# EAGLE board alu4 (EAGLE 7.6.0), part 1 of 2
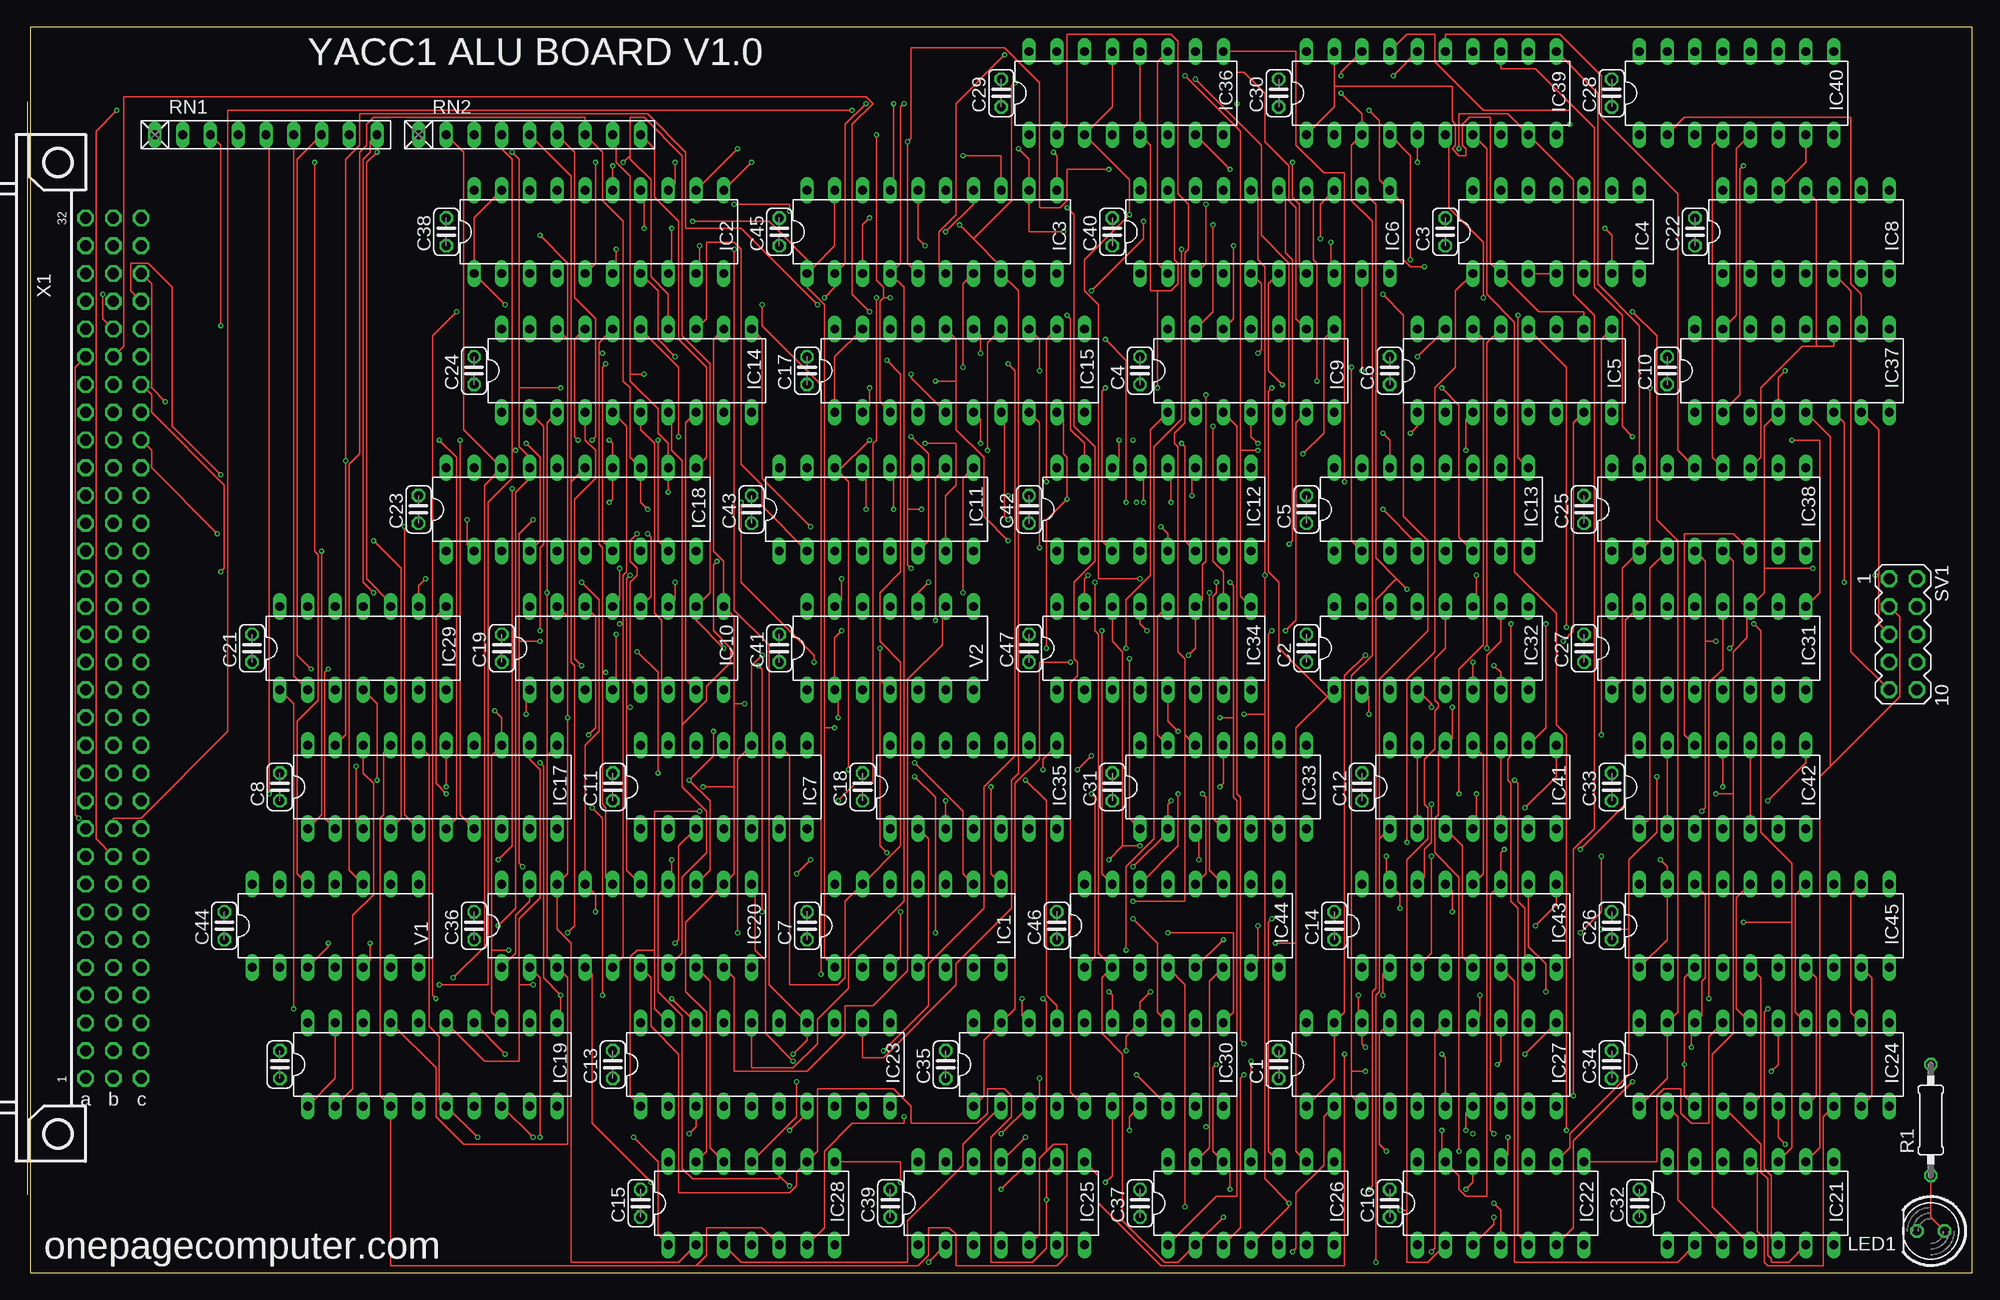
[diagram p10: board, top side]
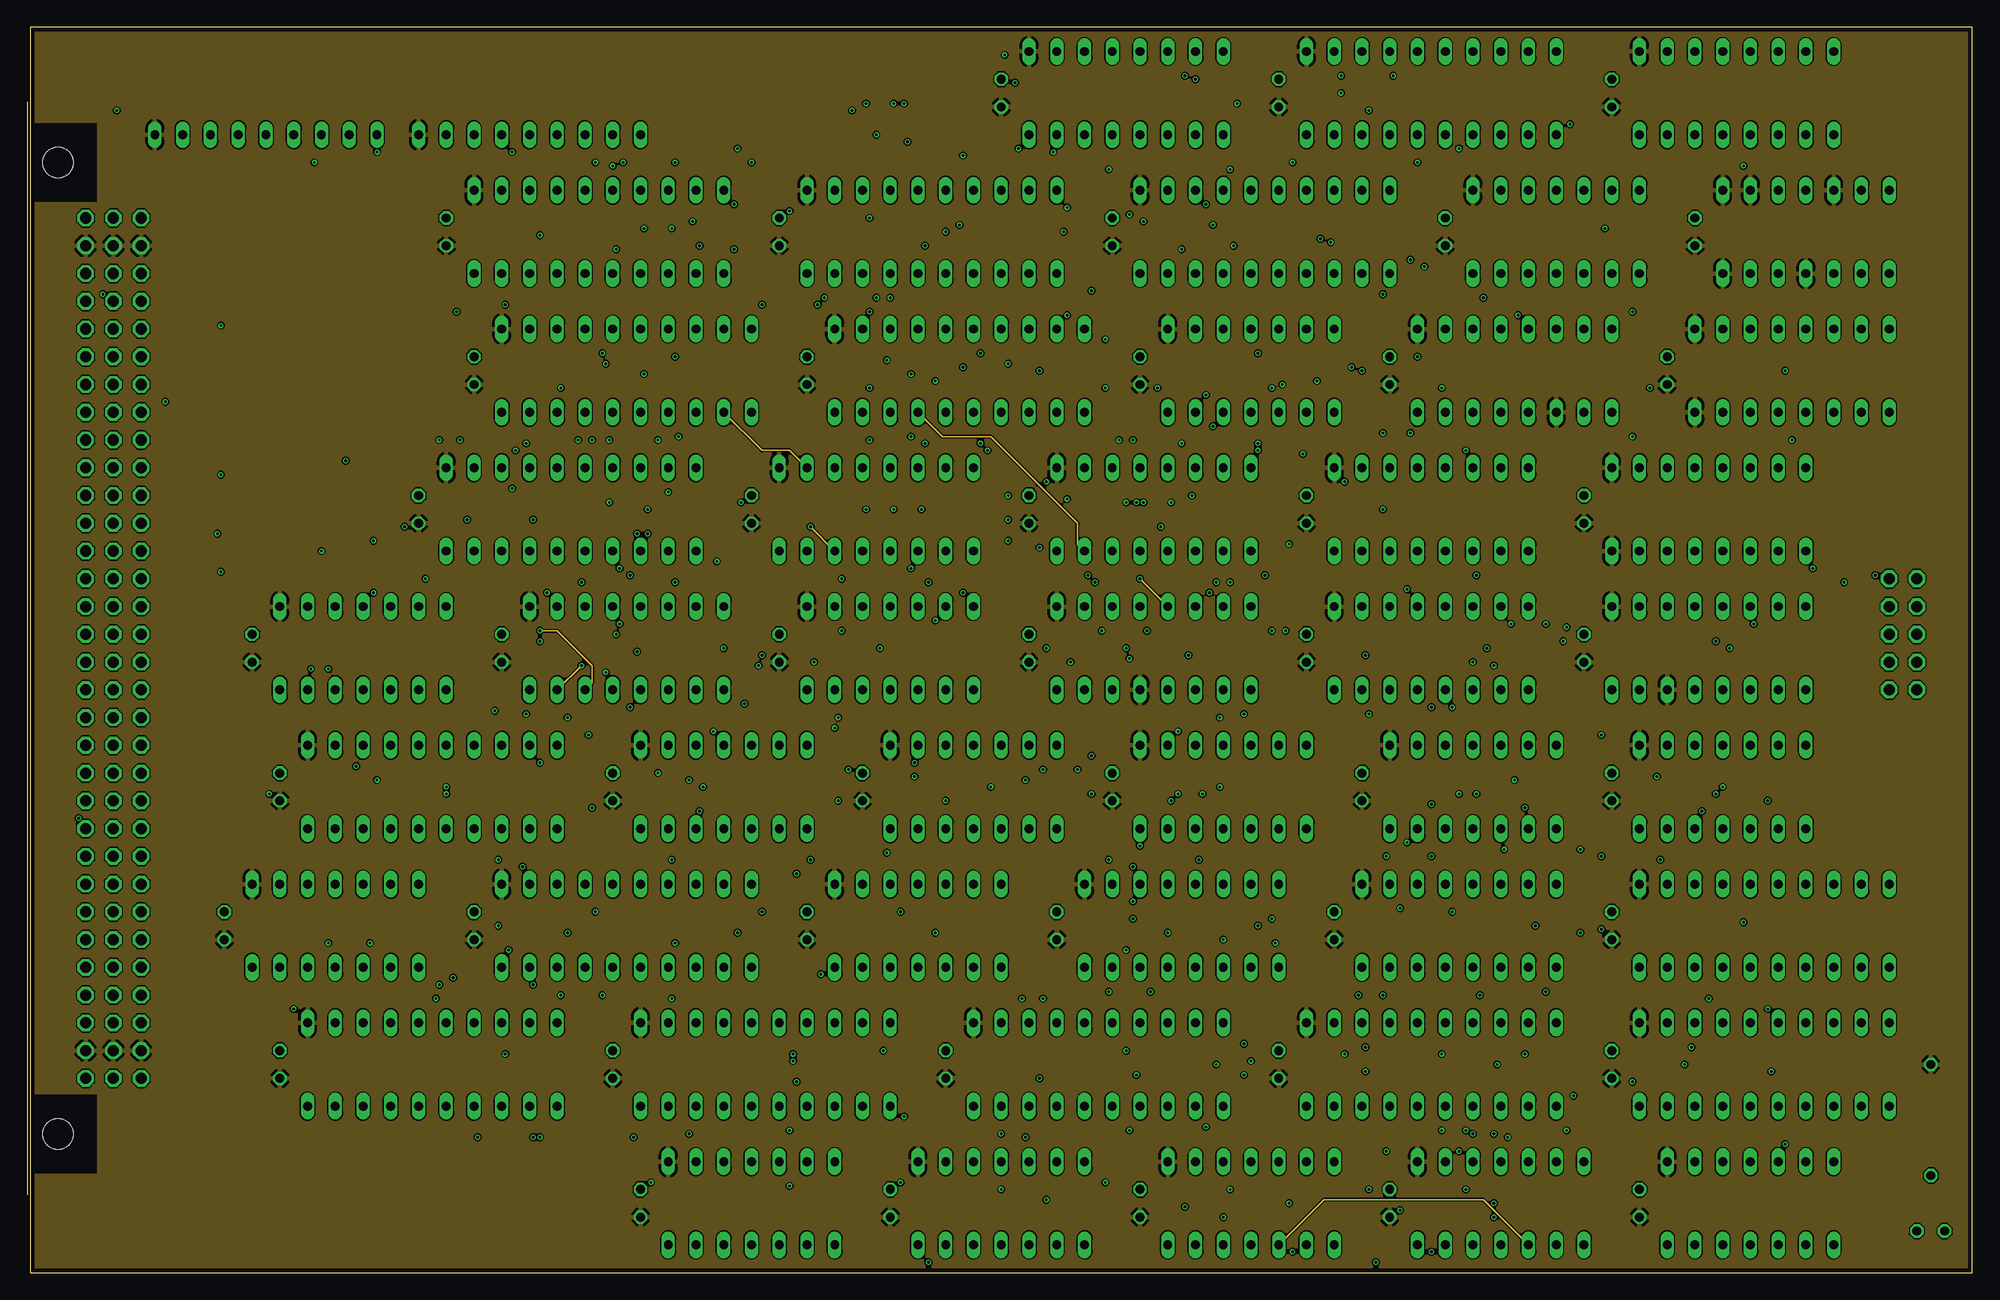
[diagram p11: board, inner layer Route2]
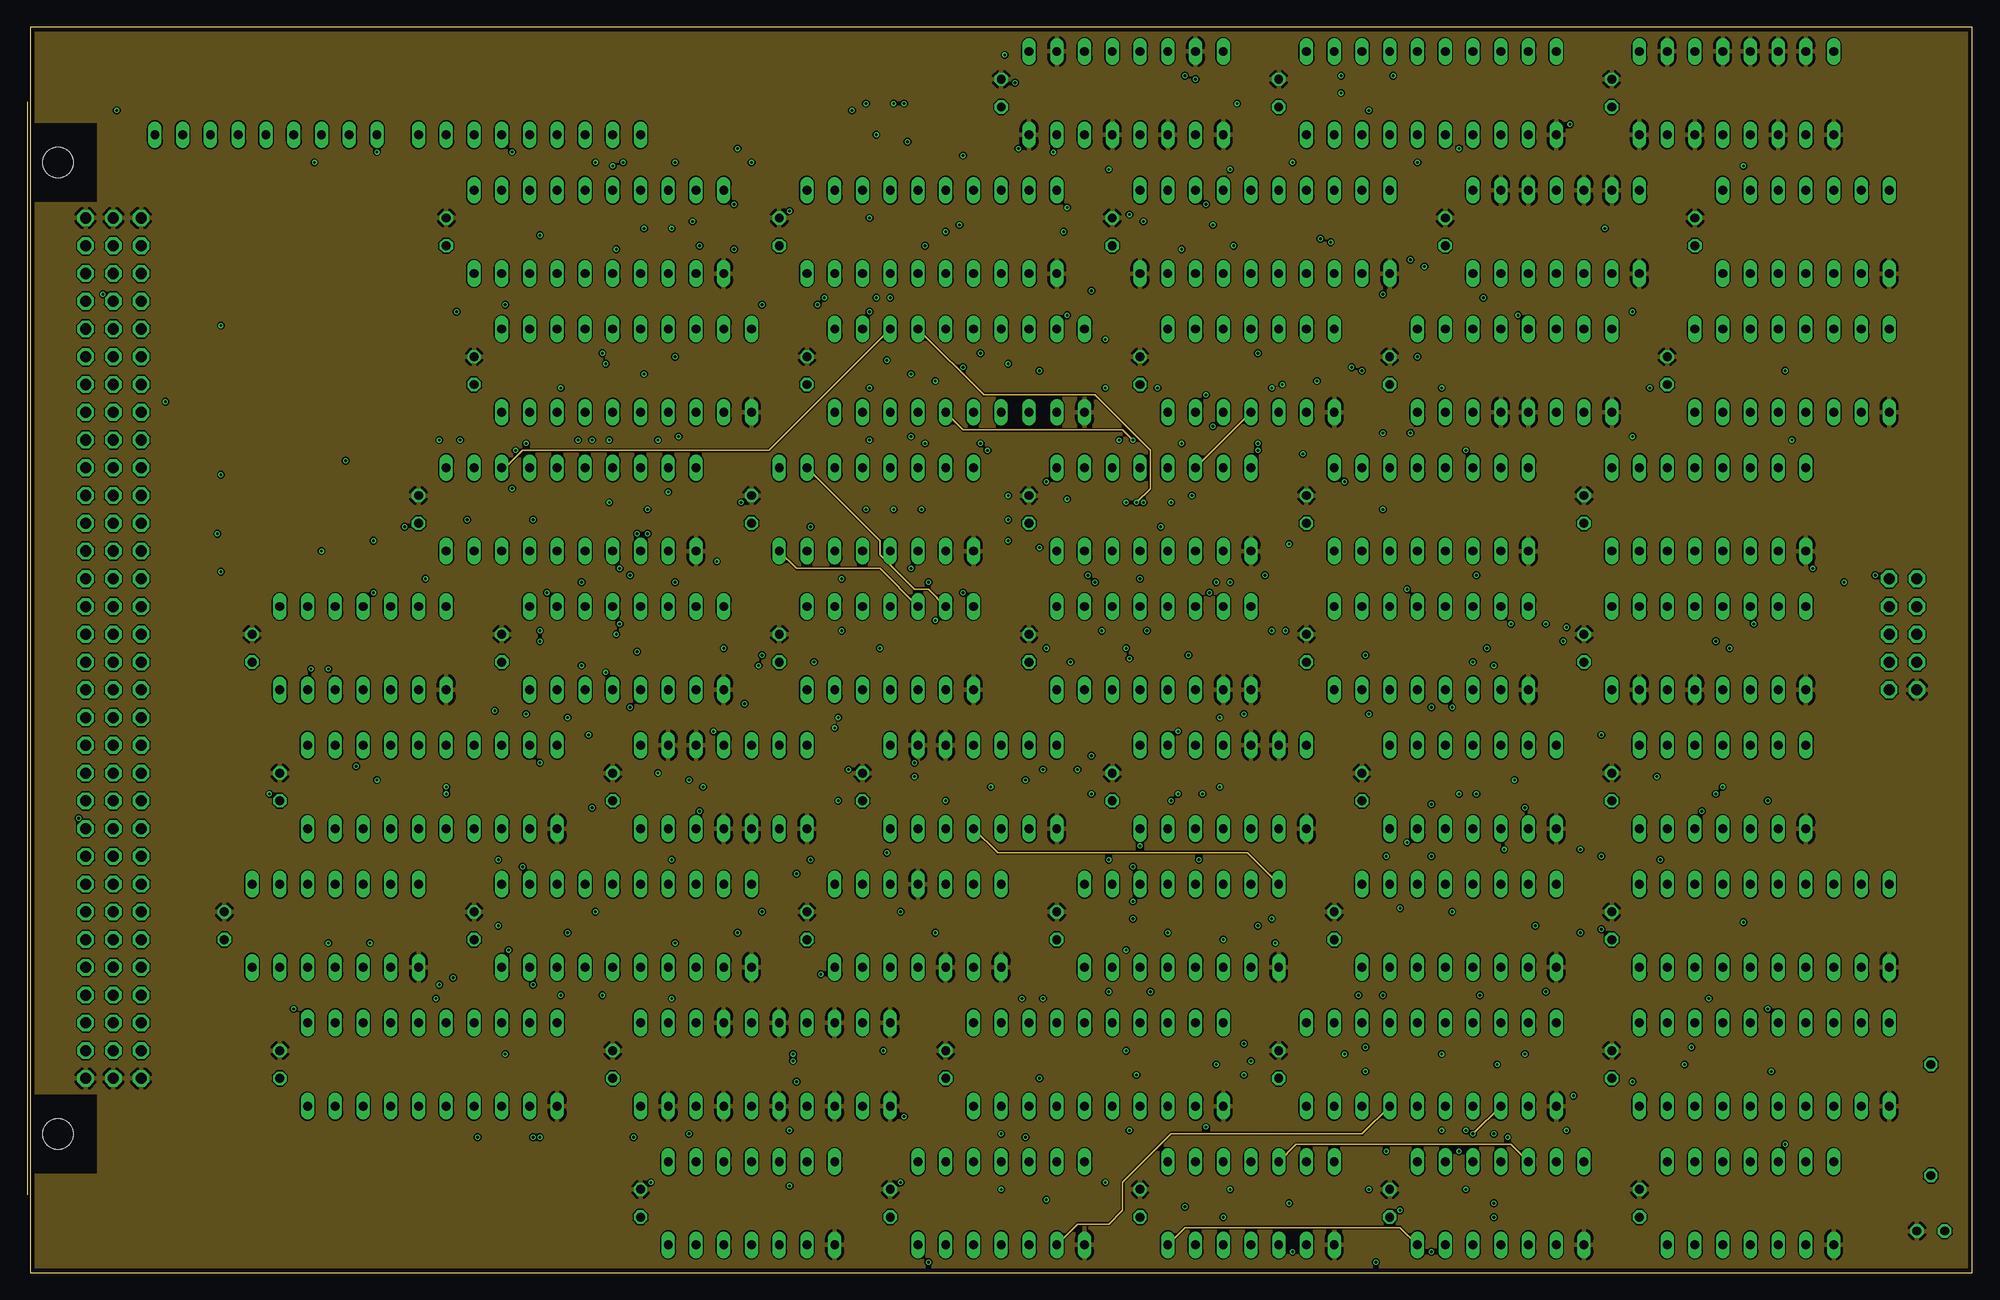
[diagram p12: board, inner layer Route15]
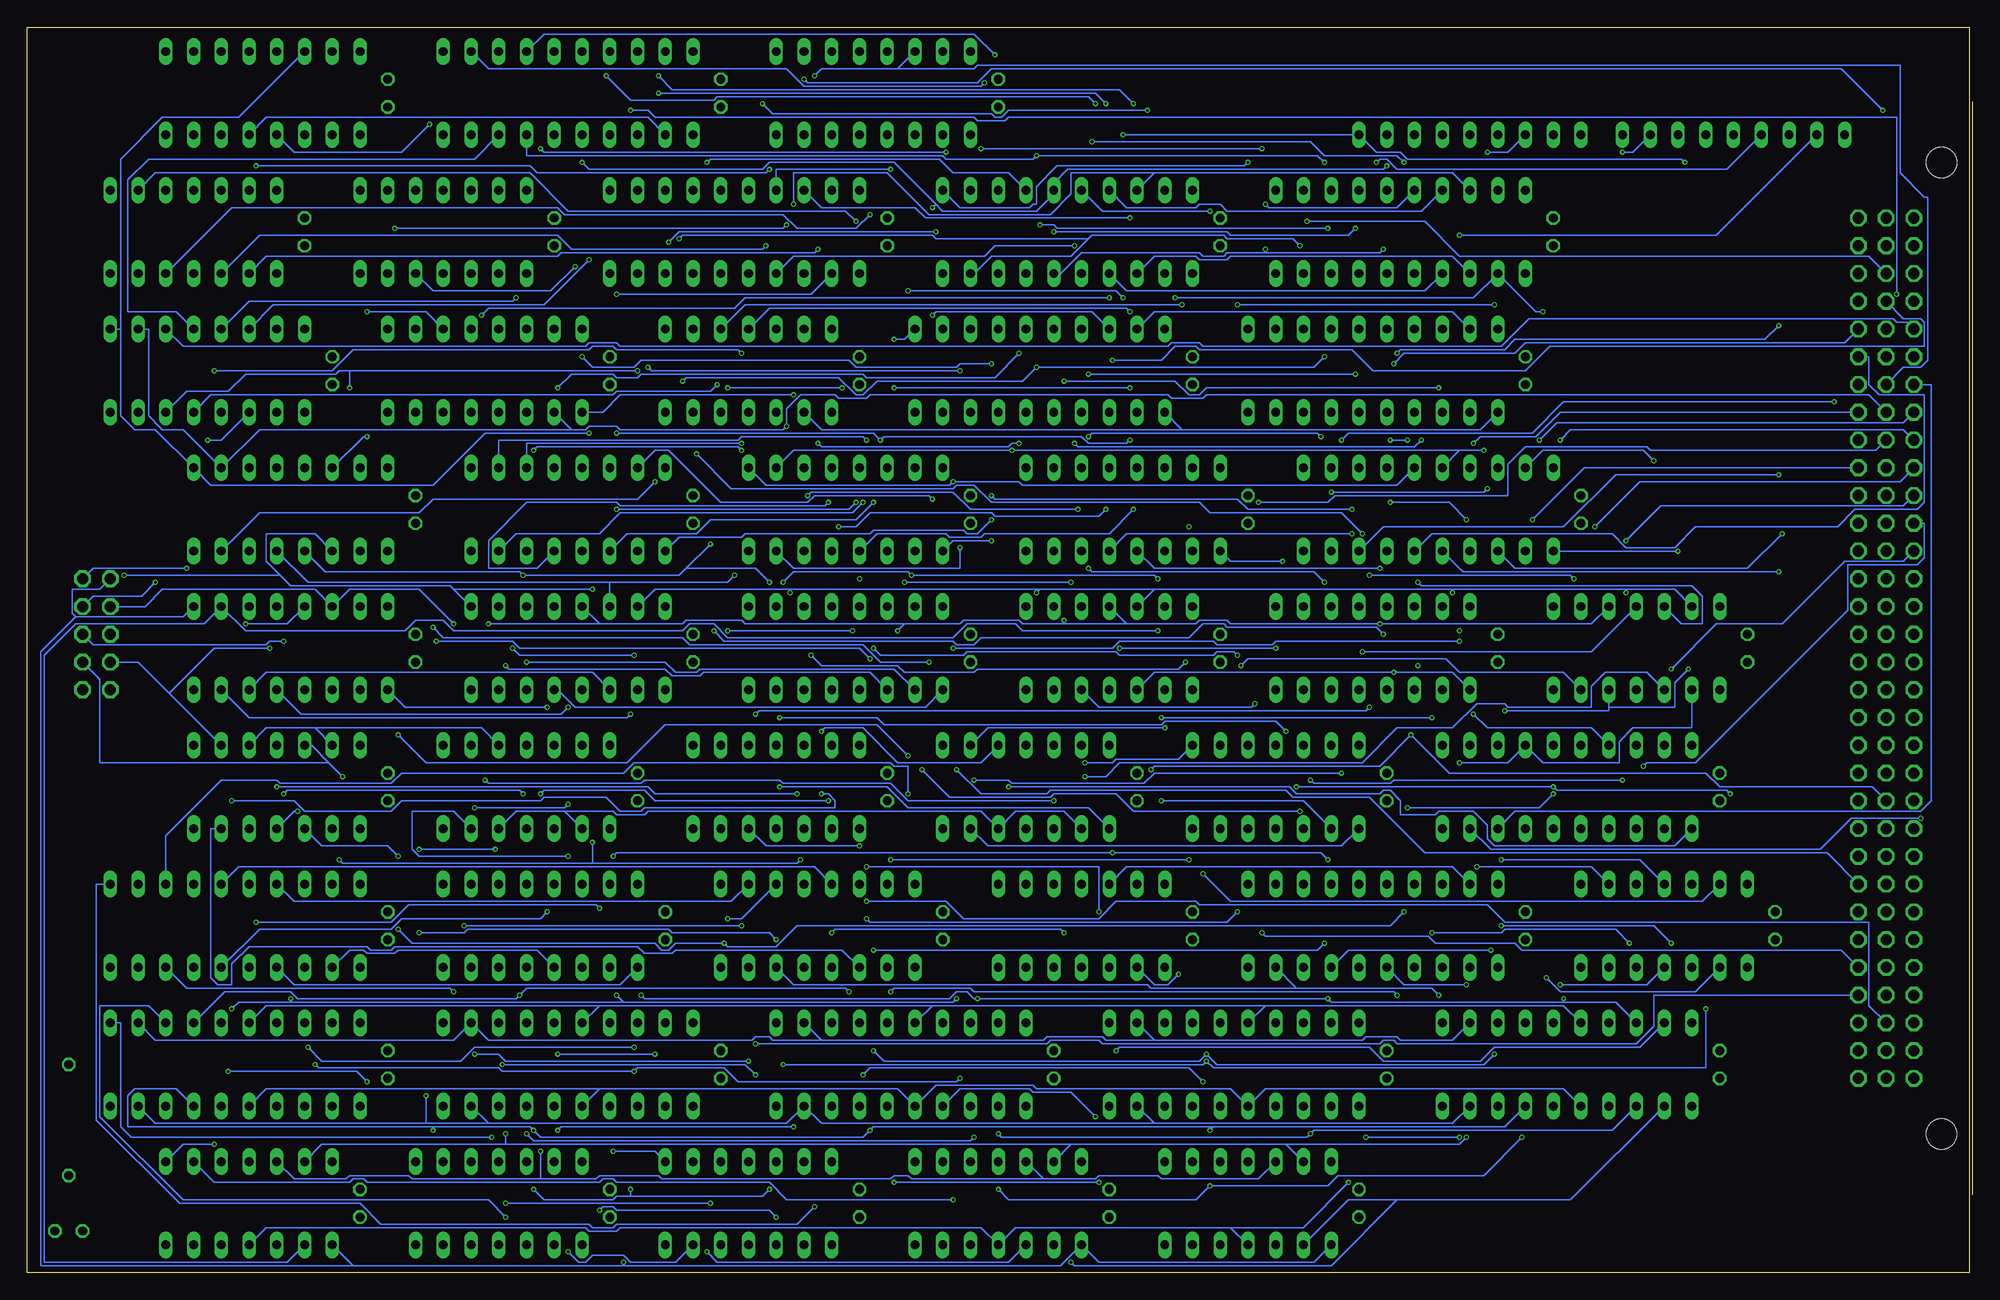
[diagram p13: board, bottom side, seen from below]

Size 177.78 x 113.97 mm. Coordinates in mm from the lower left corner, seen from the top.
Outline: 0,0 177.78,0 177.78,113.97 0,113.97 0,0
Copper layers (1*2*15*16): Top 0.035559375mm / dielectric 0.17018125mm / Route2 0.01778125mm / dielectric 47mil / Route15 0.01778125mm / dielectric 0.17018125mm / Bottom 0.035559375mm
Design rules "OSHPark-4layer": minimum track width 5mil, minimum drill 10mil, track to track 5mil, track to pad 5mil, pad to pad 5mil, via to via 5mil, smd to smd 5mil, copper to edge 15mil, drill to drill 6mil, minimum pad ring 4mil, minimum via ring 4mil, stop-mask expansion 2.5mil, vias tented up to drill 0mil, thermal gap 10mil

## Footprints (pad centres in the part's own frame; a part is rotated, then mirrored left to right if it is on the bottom)
C025-024X044 = drill 0.813 octagon: 1 -1.27,0; 2 1.27,0
DIL14 = drill 0.813 long: 1 -7.62,-3.81; 2 -5.08,-3.81; 3 -2.54,-3.81; 4 0,-3.81; 5 2.54,-3.81; 6 5.08,-3.81; 7 7.62,-3.81; 8 7.62,3.81; 9 5.08,3.81; 10 2.54,3.81; 11 0,3.81; 12 -2.54,3.81; 13 -5.08,3.81; 14 -7.62,3.81
DIL20 = drill 0.813 long: 1 -11.43,-3.81; 2 -8.89,-3.81; 3 -6.35,-3.81; 4 -3.81,-3.81; 5 -1.27,-3.81; 6 1.27,-3.81; 7 3.81,-3.81; 8 6.35,-3.81; 9 8.89,-3.81; 10 11.43,-3.81; 11 11.43,3.81; 12 8.89,3.81; 13 6.35,3.81; 14 3.81,3.81; 15 1.27,3.81; 16 -1.27,3.81; 17 -3.81,3.81; 18 -6.35,3.81; 19 -8.89,3.81; 20 -11.43,3.81
DIL16 = drill 0.813 long: 1 -8.89,-3.81; 2 -6.35,-3.81; 3 -3.81,-3.81; 4 -1.27,-3.81; 5 1.27,-3.81; 6 3.81,-3.81; 7 6.35,-3.81; 8 8.89,-3.81; 9 8.89,3.81; 10 6.35,3.81; 11 3.81,3.81; 12 1.27,3.81; 13 -1.27,3.81; 14 -3.81,3.81; 15 -6.35,3.81; 16 -8.89,3.81
LED5MM = drill 0.813 octagon: A -1.27,0; K 1.27,0
0207/10 = drill 0.813 octagon: 1 -5.08,0; 2 5.08,0
RN-9 = drill 0.813 long: 1 -10.16,0; 2 -7.62,0; 3 -5.08,0; 4 -2.54,0; 5 0,0; 6 2.54,0; 7 5.08,0; 8 7.62,0; 9 10.16,0
MA05-2 = drill 1.016 octagon: 1 -5.08,-1.27; 2 -5.08,1.27; 3 -2.54,-1.27; 4 -2.54,1.27; 5 0,-1.27; 6 0,1.27; 7 2.54,-1.27; 8 2.54,1.27; 9 5.08,-1.27; 10 5.08,1.27
FABC96R = drill 1.016 octagon: A1 -2.54,39.37; A2 -2.54,36.83; A3 -2.54,34.29; A4 -2.54,31.75; A5 -2.54,29.21; A6 -2.54,26.67; A7 -2.54,24.13; A8 -2.54,21.59; A9 -2.54,19.05; A10 -2.54,16.51; A11 -2.54,13.97; A12 -2.54,11.43; A13 -2.54,8.89; A14 -2.54,6.35; A15 -2.54,3.81; A16 -2.54,1.27; A17 -2.54,-1.27; A18 -2.54,-3.81; A19 -2.54,-6.35; A20 -2.54,-8.89; A21 -2.54,-11.43; A22 -2.54,-13.97; A23 -2.54,-16.51; A24 -2.54,-19.05; A25 -2.54,-21.59; A26 -2.54,-24.13; A27 -2.54,-26.67; A28 -2.54,-29.21; A29 -2.54,-31.75; A30 -2.54,-34.29; A31 -2.54,-36.83; A32 -2.54,-39.37; B1 -5.08,39.37; B2 -5.08,36.83; B3 -5.08,34.29; B4 -5.08,31.75; B5 -5.08,29.21; B6 -5.08,26.67; B7 -5.08,24.13; B8 -5.08,21.59; B9 -5.08,19.05; B10 -5.08,16.51; B11 -5.08,13.97; B12 -5.08,11.43; B13 -5.08,8.89; B14 -5.08,6.35; B15 -5.08,3.81; B16 -5.08,1.27; B17 -5.08,-1.27; B18 -5.08,-3.81; B19 -5.08,-6.35; B20 -5.08,-8.89; B21 -5.08,-11.43; B22 -5.08,-13.97; B23 -5.08,-16.51; B24 -5.08,-19.05; B25 -5.08,-21.59; B26 -5.08,-24.13; B27 -5.08,-26.67; B28 -5.08,-29.21; B29 -5.08,-31.75; B30 -5.08,-34.29; B31 -5.08,-36.83; B32 -5.08,-39.37; C1 -7.62,39.37; C2 -7.62,36.83; C3 -7.62,34.29; C4 -7.62,31.75; C5 -7.62,29.21; C6 -7.62,26.67; C7 -7.62,24.13; C8 -7.62,21.59; C9 -7.62,19.05; C10 -7.62,16.51; C11 -7.62,13.97; C12 -7.62,11.43; C13 -7.62,8.89; C14 -7.62,6.35; C15 -7.62,3.81; C16 -7.62,1.27; C17 -7.62,-1.27; C18 -7.62,-3.81; C19 -7.62,-6.35; C20 -7.62,-8.89; C21 -7.62,-11.43; C22 -7.62,-13.97; C23 -7.62,-16.51; C24 -7.62,-19.05; C25 -7.62,-21.59; C26 -7.62,-24.13; C27 -7.62,-26.67; C28 -7.62,-29.21; C29 -7.62,-31.75; C30 -7.62,-34.29; C31 -7.62,-36.83; C32 -7.62,-39.37 | hole 2.794: 0,-44.456; 0,44.456

## Placement (x,y rotation side)
C1  [C025-024X044]  114.3,19.05 90 top
C2  [C025-024X044]  116.84,57.15 90 top
C3  [C025-024X044]  129.54,95.25 90 top
C4  [C025-024X044]  101.6,82.55 90 top
C5  [C025-024X044]  116.84,69.85 90 top
C6  [C025-024X044]  124.46,82.55 90 top
C7  [C025-024X044]  71.12,31.75 90 top
C8  [C025-024X044]  22.86,44.45 90 top
C10  [C025-024X044]  149.86,82.55 90 top
C11  [C025-024X044]  53.34,44.45 90 top
C12  [C025-024X044]  121.92,44.45 90 top
C13  [C025-024X044]  53.34,19.05 90 top
C14  [C025-024X044]  119.38,31.75 90 top
C15  [C025-024X044]  55.88,6.35 90 top
C16  [C025-024X044]  124.46,6.35 90 top
C17  [C025-024X044]  71.12,82.55 90 top
C18  [C025-024X044]  76.2,44.45 90 top
C19  [C025-024X044]  43.18,57.15 90 top
C20  [C025-024X044]  22.86,19.05 90 top
C21  [C025-024X044]  20.32,57.15 90 top
C22  [C025-024X044]  152.4,95.25 90 top
C23  [C025-024X044]  35.56,69.85 90 top
C24  [C025-024X044]  40.64,82.55 90 top
C25  [C025-024X044]  142.24,69.85 90 top
C26  [C025-024X044]  144.78,31.75 90 top
C27  [C025-024X044]  142.24,57.15 90 top
C28  [C025-024X044]  144.78,107.95 90 top
C29  [C025-024X044]  88.9,107.95 90 top
C30  [C025-024X044]  114.3,107.95 90 top
C31  [C025-024X044]  99.06,44.45 90 top
C32  [C025-024X044]  147.32,6.35 90 top
C33  [C025-024X044]  144.78,44.45 90 top
C34  [C025-024X044]  144.78,19.05 90 top
C35  [C025-024X044]  83.82,19.05 90 top
C36  [C025-024X044]  40.64,31.75 90 top
C37  [C025-024X044]  101.6,6.35 90 top
C38  [C025-024X044]  38.1,95.25 90 top
C39  [C025-024X044]  78.74,6.35 90 top
C40  [C025-024X044]  99.06,95.25 90 top
C41  [C025-024X044]  68.58,57.15 90 top
C42  [C025-024X044]  91.44,69.85 90 top
C43  [C025-024X044]  66.04,69.85 90 top
C44  [C025-024X044]  17.78,31.75 90 top
C45  [C025-024X044]  68.58,95.25 90 top
C46  [C025-024X044]  93.98,31.75 90 top
C47  [C025-024X044]  91.44,57.15 90 top
IC1  74ALS04N  [DIL14]  81.28,31.75 0 top
IC2  74LS240N  [DIL20]  52.07,95.25 0 top
IC3  74LS244N  [DIL20]  82.55,95.25 0 top
IC4  74LS00N  [DIL14]  139.7,95.25 0 top
IC5  74LS138N  [DIL16]  135.89,82.55 0 top
IC6  74LS374N  [DIL20]  113.03,95.25 0 top
IC7  74LS32N  [DIL14]  63.5,44.45 0 top
IC8  74LS74N  [DIL14]  162.56,95.25 0 top
IC9  74ALS04N  [DIL14]  111.76,82.55 0 top
IC10  74LS192N  [DIL16]  54.61,57.15 0 top
IC11  74LS192N  [DIL16]  77.47,69.85 0 top
IC12  74LS192N  [DIL16]  102.87,69.85 0 top
IC13  74LS192N  [DIL16]  128.27,69.85 0 top
IC14  74LS244N  [DIL20]  54.61,82.55 0 top
IC15  74LS244N  [DIL20]  85.09,82.55 0 top
IC17  74LS245N  [DIL20]  36.83,44.45 0 top
IC18  74LS245N  [DIL20]  49.53,69.85 0 top
IC19  74LS244N  [DIL20]  36.83,19.05 0 top
IC20  74LS244N  [DIL20]  54.61,31.75 0 top
IC21  74LS86N  [DIL14]  157.48,6.35 0 top
IC22  74LS86N  [DIL14]  134.62,6.35 0 top
IC23  74LS244N  [DIL20]  67.31,19.05 0 top
IC24  74LS244N  [DIL20]  158.75,19.05 0 top
IC25  74LS08N  [DIL14]  88.9,6.35 0 top
IC26  74LS08N  [DIL14]  111.76,6.35 0 top
IC27  74LS244N  [DIL20]  128.27,19.05 0 top
IC28  74LS32N  [DIL14]  66.04,6.35 0 top
IC29  74LS32N  [DIL14]  30.48,57.15 0 top
IC30  74LS244N  [DIL20]  97.79,19.05 0 top
IC31  74LS85N  [DIL16]  153.67,57.15 0 top
IC32  74LS85N  [DIL16]  128.27,57.15 0 top
IC33  74ALS08N  [DIL14]  109.22,44.45 0 top
IC34  74LS251N  [DIL16]  102.87,57.15 0 top
IC35  74LS86N  [DIL14]  86.36,44.45 0 top
IC36  74LS153N  [DIL16]  100.33,107.95 0 top
IC37  74LS194N  [DIL16]  161.29,82.55 0 top
IC38  74LS194N  [DIL16]  153.67,69.85 0 top
IC39  74LS244N  [DIL20]  128.27,107.95 0 top
IC40  74LS153N  [DIL16]  156.21,107.95 0 top
IC41  74LS86N  [DIL14]  132.08,44.45 0 top
IC42  74LS86N  [DIL14]  154.94,44.45 0 top
IC43  74LS283N  [DIL16]  130.81,31.75 0 top
IC44  74LS283N  [DIL16]  105.41,31.75 0 top
IC45  74LS244N  [DIL20]  158.75,31.75 0 top
LED1  [LED5MM]  173.99,3.81 180 top
R1  330  [0207/10]  173.99,13.97 90 top
RN1  10k  [RN-9]  21.59,104.14 0 top
RN2  10k  [RN-9]  45.72,104.14 0 top
SV1  [MA05-2]  171.45,58.42 270 top
V1  744078N  [DIL14]  27.94,31.75 0 top
V2  744078N  [DIL14]  78.74,57.15 0 top
X1  FABC96R  [FABC96R]  2.54,57.15 180 top

## Tracks (layer width: path | path; a pad name or v marks a point on that pad's centre or on a via)
-ADD  (via drill 0.25)
  Top 0.127: IC33.1 100.65,41.59 v100.65,56.2 | v140.34,57.78 141.29,58.74 141.29,77.79 IC5.7
  Bottom 0.127: v100.65,56.2 101.6,57.15 132.72,57.15 133.35,57.78 v140.34,57.78
-ADD/SUB  (via drill 0.25)
  Top 0.127: IC33.3 107,40.32 v107,37.78 | v149.22,37.78 149.86,37.15 IC45.19 149.86,30.48 IC45.1 | IC4.1 130.49,89.85 130.49,82.87 128.59,80.96 128.59,56.83 126.05,54.29 v126.05,39.37
  Bottom 0.127: v107,37.78 107.31,37.47 126.05,37.47 | 126.05,37.47 148.91,37.47 v149.22,37.78 | 126.05,37.47 v126.05,39.37
-AND  (via drill 0.25)
  Top 0.127: IC27.1 119.38,17.78 IC27.19 120.33,23.81 120.33,54.61 v122.24,56.52 | IC5.13 133.35,85.09 v133.35,57.15
  Bottom 0.127: v133.35,57.15 132.72,56.52 v122.24,56.52
-BUS-OUT  (via drill 0.25)
  Top 0.127: IC17.1 26.67,41.91 v26.67,66.04 | IC1.8 87.95,36.51 v87.95,44.45
  Bottom 0.127: IC18.1 v26.67,66.04 | v87.95,44.45 62.23,44.45 61.59,43.81 53.98,43.81 53.66,44.13 53.02,44.13 52.07,43.18 52.07,41.91 48.9,41.91 48.58,42.23 45.4,42.23 44.13,40.96 44.13,39.69 43.5,39.05 26.99,39.05 IC17.1
-DATA  (via drill 0.25)
  Top 0.127: IC19.1 27.94,17.78 IC19.19 | v127,83.82 IC5.15 | v89.53,83.19 90.17,82.55 90.17,47.31 87.31,44.45 87.31,33.34 82.23,28.26 82.23,24.45 v78.11,20.32
  Bottom 0.127: v127,83.82 126.05,82.87 122.24,82.87 121.6,83.5 102.55,83.5 101.92,82.87 92.71,82.87 92.39,83.19 v89.53,83.19 | v78.11,20.32 77.79,20.64 54.93,20.64 53.66,19.37 44.77,19.37 43.5,20.64 30.16,20.64 IC19.19
-I/D-REG-DN  (via drill 0.25)
  Top 0.127: IC10.4 53.66,53.66 v53.66,58.42 | v114.94,58.74 115.89,59.69 115.89,77.79 IC9.6
  Bottom 0.127: v53.66,58.42 54.29,59.05 67.94,59.05 68.26,59.37 70.17,59.37 71.44,58.1 90.49,58.1 91.12,57.47 92.71,57.47 93.03,57.78 113.98,57.78 v114.94,58.74
-I/D-REG-LD  (via drill 0.25)
  Top 0.127: v112.39,75.88 111.76,76.52 IC9.4 | IC10.11 59.05,61.59 v59.05,63.18 | v80.64,64.45 80.33,64.77 80.33,69.85 | 80.33,69.85 80.33,72.71 IC11.11 | IC12.11 106.36,73.34 v106.36,71.12 | 80.33,69.85 v81.6,69.85
  Route15 0.127: IC9.4 IC12.11
  Bottom 0.127: IC13.11 132.08,75.88 v112.39,75.88 | v59.05,63.18 60.01,64.14 80.33,64.14 v80.64,64.45 | v106.36,71.12 106.05,71.44 93.03,71.44 91.44,69.85 v81.6,69.85
-I/D-REG-OUT
  Top 0.127: IC15.19 73.66,83.82 IC15.1
  Bottom 0.127: IC14.19 47.31,87.95 74.61,87.95 IC15.19 | IC14.1 44.77,77.15 72.07,77.15 | IC15.1 72.07,77.15 | IC9.2 105.09,77.15 72.07,77.15
-I/D-REG-UP  (via drill 0.25)
  Top 0.127: IC10.5 54.93,54.29 54.93,63.18 55.56,63.82 55.56,64.45 54.93,65.09 54.93,66.99 v55.56,67.63 | v116.52,74.93 118.43,76.83 118.43,85.41 IC9.8
  Bottom 0.127: v55.56,67.63 57.47,69.53 69.53,69.53 70.48,70.48 89.53,70.48 91.12,72.07 92.71,72.07 93.03,71.75 113.35,71.75 v116.52,74.93
-OR  (via drill 0.25)
  Top 0.127: IC30.1 87.31,16.19 87.31,21.27 IC30.19 90.17,24.13 90.17,44.77 92.39,46.99 92.39,55.88 v95.25,55.88 | IC5.12 140.65,82.87 v140.65,59.05
  Bottom 0.127: v140.65,59.05 139.7,58.1 117.79,58.1 117.16,57.47 101.28,57.47 99.69,55.88 v95.25,55.88
-RD-AC
  Top 0.127: IC20.1 44.45,29.21 44.45,32.7 45.72,33.97 IC20.19
  Bottom 0.127: IC1.12 77.15,37.15 47.31,37.15 IC20.19
-SHIFT
  Top 0.127: IC39.1 119.38,106.68 119.38,108.58 | IC39.19 119.38,108.58 | IC5.10 142.24,87.95 138.11,87.95 IC4.2 133.67,92.39 133.67,105.73 131.76,105.73 131.13,105.09 131.13,103.19 131.44,102.87 131.44,102.23 130.81,102.23 130.18,102.87 130.49,103.19 130.49,105.09 130.18,105.41 130.18,108.58 119.38,108.58
-SUB  (via drill 0.25)
  Top 0.127: IC1.3 79.69,28.89 v79.69,33.02 | v100.97,37.15 104.14,40.32 IC33.2 104.14,42.86 v104.46,43.18 | IC5.14 133.03,85.41 133.03,57.47 130.81,55.24 v130.81,43.81
  Bottom 0.127: v79.69,33.02 79.69,37.15 v100.97,37.15 | v130.81,43.81 130.49,44.13 121.28,44.13 120.33,43.18 v104.46,43.18
-XOR  (via drill 0.25)
  Top 0.127: IC24.1 149.86,17.78 IC24.19 150.81,23.81 150.81,66.99 148.91,68.9 148.91,85.72 v146.69,87.95
  Bottom 0.127: IC5.11 141.29,87.95 v146.69,87.95
-ZERO  (via drill 0.25)
  Top 0.127: IC23.1 54.93,16.19 54.93,28.89 55.56,29.53 57.15,29.53 | 57.15,29.53 57.15,24.13 IC23.19 | IC5.9 143.83,85.41 v143.83,49.21 | v95.89,46.04 v97.16,47.31 | v61.28,42.23 57.15,42.23 57.15,29.53
  Bottom 0.127: v143.83,49.21 141.29,46.67 122.87,46.67 119.38,50.16 100.01,50.16 v97.16,47.31 | v95.89,46.04 93.34,43.5 84.14,43.5 83.82,43.81 78.11,43.81 76.52,42.23 v61.28,42.23
AC-IN-INV  (via drill 0.25)
  Top 0.127: 71.75,92.08 73.66,93.98 IC3.19 | 71.75,92.08 IC3.1 71.12,90.17 72.71,88.58 72.71,49.85 | IC1.1 72.71,28.89 72.71,49.85 | 72.71,49.85 v73.66,49.85 | v60.64,96.2 67.63,96.2 71.75,92.08
  Bottom 0.127: IC35.9 89.85,49.85 v73.66,49.85 | X1.B30 9.21,93.03 46.67,93.03 49.85,96.2 v60.64,96.2
ACI-DATA0  (via drill 0.25)
  Top 0.127: IC6.3 107.63,92.39 v107.63,97.79
  Bottom 0.127: IC2.18 47.31,100.65 74.61,100.65 | IC3.18 74.61,100.65 | v107.63,97.79 107.63,100.65 99.06,100.65 95.25,96.84 84.14,96.84 82.23,98.74 82.23,100.65 74.61,100.65
ACI-DATA1  (via drill 0.25)
  Top 0.127: v64.45,97.79 69.53,97.79 v69.53,97.16 | v81.92,93.98 81.28,94.61 IC3.16
  Bottom 0.127: IC2.16 52.39,97.47 64.14,97.47 v64.45,97.79 | v69.53,97.16 79.38,97.16 IC3.16 | IC6.4 107.63,93.03 90.17,93.03 89.22,93.98 v81.92,93.98
ACI-DATA2  (via drill 0.25)
  Top 0.127: IC2.14 56.2,98.74 v56.2,95.57 | v83.82,95.25 86.36,97.79 IC3.14 | IC6.7 116.2,92.08 116.2,97.79 115.57,98.42 v115.57,101.6
  Bottom 0.127: v56.2,95.57 56.83,94.93 67.63,94.93 67.94,95.25 v83.82,95.25 | v115.57,101.6 115.25,101.92 94.3,101.92 93.03,100.65 87.95,100.65 IC3.14
ACI-DATA3  (via drill 0.25)
  Top 0.127: v64.77,102.87 IC2.12 | v90.49,102.87 91.44,101.92 IC3.12 91.44,95.25 v94.61,95.25 | IC6.8 119.06,91.76 v119.06,94.3
  Bottom 0.127: v90.49,102.87 v64.77,102.87 | v119.06,94.3 118.11,95.25 v94.61,95.25
ACI-DATA4  (via drill 0.25)
  Top 0.127: IC2.9 61.28,91.76 v61.28,93.98 | IC6.13 118.11,97.79 v118.11,94.61
  Bottom 0.127: v61.28,93.98 61.91,94.61 67.94,94.61 68.26,94.93 80.33,94.93 80.64,94.61 | 80.64,94.61 82.23,93.03 89.53,93.03 91.12,91.44 IC3.9 | v118.11,94.61 117.79,94.93 94.93,94.93 94.61,94.61 80.64,94.61
ACI-DATA5  (via drill 0.25)
  Top 0.127: IC2.7 57.47,89.85 57.47,85.41 v59.05,83.82 | v85.41,82.87 85.41,90.49 IC3.7 | IC6.14 117.47,98.42 117.47,92.71 117.79,92.39 v117.79,81.6
  Bottom 0.127: v59.05,83.82 60.01,82.87 v85.41,82.87 86.68,81.6 100.01,81.6 101.28,80.33 101.92,80.33 103.5,81.92 117.47,81.92 v117.79,81.6
ACI-DATA6  (via drill 0.25)
  Top 0.127: IC2.5 51.75,92.39 v51.75,101.6 | IC3.5 80.33,92.39 v80.33,103.5 80.64,103.82 80.64,112.08 89.22,112.08 92.39,108.9 92.39,97.47 94.3,97.47 94.93,98.11 94.93,100.97 v98.74,100.97
  Bottom 0.127: v51.75,101.6 52.39,102.23 59.05,102.23 60.33,103.5 v80.33,103.5 | IC6.17 109.22,100.97 v98.74,100.97
ACI-DATA7  (via drill 0.25)
  Top 0.127: v76.83,96.52 76.2,95.89 IC3.3
  Bottom 0.127: IC2.3 47.31,93.03 67.63,93.03 67.94,92.71 70.48,92.71 70.8,93.03 74.61,93.03 IC3.3 | IC6.18 105.09,97.47 96.52,97.47 95.57,96.52 v76.83,96.52
ACO-DATA0  (via drill 0.25)
  Top 0.127: v161.29,76.2 163.83,76.2 163.83,62.23 IC31.9 | IC6.2 103.19,92.39 103.19,110.81 IC36.11 | IC20.2 46.67,26.99 v46.67,12.38 | v55.24,12.38 57.47,10.16 57.47,3.49 IC28.1 | 123.51,39.69 IC41.1 | 123.51,39.69 123.51,25.72 123.19,25.4 v123.19,0.95 | v123.83,89.53 125.73,87.63 125.73,69.22 127.95,66.99 127.95,58.74 123.51,54.29 123.51,39.69
  Bottom 0.127: IC31.9 163.51,60.01 173.35,60.01 | 173.35,60.01 173.67,60.33 173.67,62.55 171.13,62.55 SV1.1 | IC37.3 160.02,76.2 v161.29,76.2 | IC28.1 60.01,0.95 79.69,0.95 IC25.1 83.19,0.64 123.19,0.64 | 147.96,0.64 IC21.1 | 123.19,0.64 147.96,0.64 | v55.24,12.38 v46.67,12.38 | 123.19,0.64 v123.19,0.95 | IC6.2 106.05,89.53 v123.83,89.53 | 173.35,60.01 176.53,56.83 176.53,0.64 147.96,0.64
ACO-DATA1  (via drill 0.25)
  Top 0.127: IC20.4 51.44,27.3 51.44,13.65 v56.83,8.26 | IC21.4 153.99,6.03 153.99,20 155.89,21.91 155.89,43.81 | 155.89,43.81 155.89,56.83 157.16,58.1 157.16,60.64 IC31.11 158.75,62.23 158.75,64.45 | IC41.4 132.4,40.96 v132.4,43.81 | 155.89,43.81 v154.31,43.81 | 158.75,64.45 158.75,77.47 IC37.4 160.02,81.92 v160.66,82.55 | IC6.5 112.71,90.49 112.71,84.45 v112.39,84.14 | 158.75,64.45 v163.19,64.45
  Bottom 0.127: 67.63,4.13 IC28.4 | 67.63,4.13 87.31,4.13 IC25.4 90.49,4.13 123.51,4.13 123.83,3.81 126.36,3.81 126.68,4.13 155.89,4.13 IC21.4 | v56.83,8.26 60.96,4.13 67.63,4.13 | v132.4,43.81 132.72,44.13 153.99,44.13 v154.31,43.81 | v112.39,84.14 112.71,84.45 123.83,84.45 124.14,84.77 126.05,84.77 126.36,84.45 147.96,84.45 149.86,82.55 v160.66,82.55 | SV1.2 171.77,64.45 v163.19,64.45
ACO-DATA2  (via drill 0.25)
  Top 0.127: IC20.6 56.83,26.99 56.83,22.54 59.37,20 59.37,7.3 69.53,7.3 70.17,7.94 70.17,9.21 IC28.9 72.07,11.11 72.07,16.83 79.06,16.83 80.64,15.24 80.64,13.65 86.68,13.65 87.63,14.61 87.63,16.83 89.22,16.83 89.85,16.19 89.85,14.29 87.95,12.38 87.95,0.95 91.76,0.95 93.03,2.22 v93.03,6.67 93.03,9.21 IC25.9 | IC41.9 138.75,49.85 v138.75,59.37 | IC21.9 163.83,11.43 163.83,45.4 164.78,46.35 | 164.78,46.35 171.13,52.7 171.13,60.01 SV1.3 | IC37.5 164.78,76.52 164.78,46.35 | IC6.6 113.35,90.49 113.35,82.55 v114.62,81.28
  Bottom 0.127: v138.75,59.37 141.92,62.55 148.27,62.55 IC31.14 151.45,62.55 165.42,62.55 167,60.96 SV1.3 | v114.62,81.28 115.25,80.64 123.83,80.64 124.14,80.33 160.97,80.33 IC37.5 | v93.03,6.67 108.27,6.67 109.86,8.26 123.83,8.26 124.14,8.57 125.09,8.57 125.41,8.26 146.69,8.26 147,8.57 147.96,8.57 148.27,8.26 160.66,8.26 IC21.9
ACO-DATA3  (via drill 0.25)
  Top 0.127: v130.18,51.75 130.18,48.9 IC41.12 128.91,47.62 128.91,41.91 128.59,41.59 128.59,38.42 130.81,36.2 v130.81,11.11 | IC31.1 145.73,54.29 145.73,64.45 IC38.2 148.27,66.99 v148.27,80.96 | IC37.6 166.05,77.79 v166.05,63.18 | v121.92,82.55 IC6.9 | IC28.12 62.23,11.43 62.23,26.67 IC20.8
  Bottom 0.127: v130.18,51.75 143.19,51.75 IC31.1 | v166.05,63.18 167.32,61.91 171.77,61.91 SV1.4 | 148.27,82.55 149.22,82.55 149.54,82.23 157.8,82.23 159.38,80.64 163.19,80.64 IC37.6 | 148.27,82.55 v121.92,82.55 | 148.27,82.55 v148.27,80.96 | 84.77,8.57 IC25.12 | 84.77,8.57 80.01,8.57 79.69,8.89 74.3,8.89 73.98,8.57 65.09,8.57 IC28.12 | IC21.12 153.35,8.57 148.59,8.57 148.27,8.89 142.88,8.89 142.56,8.57 130.81,8.57 | 130.81,8.57 125.73,8.57 125.41,8.89 120.02,8.89 119.7,8.57 98.74,8.57 98.42,8.89 97.16,8.89 96.84,8.57 84.77,8.57 | 130.81,8.57 v130.81,11.11
ACO-DATA4  (via drill 0.25)
  Top 0.127: IC37.7 169.23,77.15 169.23,63.82 | 169.23,63.82 169.23,59.37 SV1.5 | IC42.1 148.27,41.59 148.27,64.45 IC38.3 | IC6.12 123.19,97.79 123.19,65.41 125.09,63.5 | v126.05,62.55 125.09,63.5 | v168.91,63.82 169.23,63.82 | v109.86,7.62 109.86,9.53 IC26.12 108.27,11.11 108.27,18.73 v108.58,19.05 | v131.44,7.62 132.08,8.26 IC22.12 | IC20.11 66.36,35.24 66.36,29.53 67.31,28.57 67.31,21.91 v69.85,19.37 | IC29.1 24.13,52.07 v24.13,24.13 | 125.09,63.5 123.19,61.59 123.19,26.04 122.87,25.72 122.87,7.94 v122.56,7.62
  Bottom 0.127: 138.75,62.55 139.06,62.87 153.67,62.87 154.62,63.82 | 138.75,62.55 IC32.9 | 154.62,63.82 155.89,65.09 155.89,67.63 151.45,67.63 IC38.3 | 138.75,62.55 v126.05,62.55 | 154.62,63.82 v168.91,63.82 | v109.86,7.62 110.49,6.99 122.56,6.99 | 122.56,6.99 123.83,6.99 124.14,6.67 130.49,6.67 v131.44,7.62 | v108.58,19.05 70.17,19.05 v69.85,19.37 69.22,18.73 24.13,18.73 v24.13,24.13 | 122.56,6.99 v122.56,7.62
ACO-DATA5  (via drill 0.25)
  Top 0.127: IC29.4 31.75,52.07 v31.75,45.09 | IC20.13 62.23,36.83 62.23,43.18 v60.33,45.09 62.55,47.31 v62.55,49.53 | IC32.11 132.4,61.28 v132.4,63.82 | v153.03,42.23 153.35,42.55 153.35,57.78 | 153.35,57.78 153.35,65.09 IC38.4 | IC6.15 114.94,98.42 114.94,93.34 115.57,92.71 115.57,66.99 v115.25,66.67 | 153.35,57.78 v154.31,57.78 | IC26.1 108.58,6.99 110.49,6.99 110.49,43.18 110.17,43.5 110.17,50.8 | 110.17,50.8 110.17,62.87 v109.86,63.18 | 110.17,50.8 v108.9,50.8
  Route15 0.127: IC26.1 105.73,4.13 125.41,4.13 IC22.1
  Bottom 0.127: v31.75,45.09 52.7,45.09 53.02,44.77 60.01,44.77 v60.33,45.09 | IC38.4 150.5,64.14 132.72,64.14 v132.4,63.82 118.11,63.82 117.47,64.45 | IC42.4 153.35,42.23 v153.03,42.23 | 117.47,64.45 v115.25,66.67 | SV1.6 171.77,57.47 155.89,57.47 155.57,57.78 v154.31,57.78 | v109.86,63.18 111.12,64.45 117.47,64.45 | v62.55,49.53 63.5,50.48 73.66,50.48 73.98,50.16 99.38,50.16 100.01,50.8 v108.9,50.8
ACO-DATA6  (via drill 0.25)
  Top 0.127: IC20.15 54.61,36.83 54.61,51.75 | 54.61,51.75 54.61,63.5 v54.93,63.82 | v36.2,63.5 35.56,62.87 IC29.9 | IC26.4 115.25,6.03 v115.25,6.35 113.03,8.57 113.03,51.12 | v133.99,6.35 134.62,5.71 IC22.4 | IC6.16 112.39,98.42 112.39,92.71 113.03,92.08 v113.03,63.82 113.03,51.12 | v155.57,57.15 155.89,57.47 155.89,65.09 IC38.5 | v54.93,51.75 54.61,51.75 | 113.03,51.12 v111.12,51.12
  Bottom 0.127: v54.93,63.82 36.51,63.82 v36.2,63.5 | v133.99,6.35 v115.25,6.35 | 164.78,53.02 167.64,55.88 SV1.7 | 164.78,53.02 IC42.9 | 124.46,63.18 IC32.14 | 124.46,63.18 152.08,63.18 IC38.5 | v113.03,63.82 113.67,63.18 124.46,63.18 | 164.78,53.02 160.66,57.15 v155.57,57.15 | v54.93,51.75 55.24,51.44 110.81,51.44 v111.12,51.12
ACO-DATA7  (via drill 0.25)
  Top 0.127: IC22.9 140.97,11.43 140.97,12.7 146.37,18.1 146.37,31.43 | 146.37,31.43 146.37,37.78 148.91,40.32 v148.91,45.4 | IC38.6 155.89,67.63 151.45,67.63 151.45,49.21 IC42.12 | v50.48,63.18 52.07,61.59 52.07,49.53 50.8,48.26 IC20.17 51.75,34.61 v51.75,33.02 | IC36.12 IC36.5 102.55,103.19 102.55,89.85 103.19,89.85 | IC6.19 104.78,98.42 104.78,92.71 105.09,92.39 105.09,90.49 104.46,89.85 103.19,89.85 | IC26.9 115.89,11.11 115.89,30.16 | 115.89,30.16 115.89,49.85 118.75,52.7 | IC32.1 118.75,52.7 | v103.19,80.96 103.19,89.85 | v113.67,80.96 113.35,80.64 113.35,64.14 114.3,63.18 114.3,57.15 118.75,52.7 | 115.89,30.16 v113.98,30.16 | v143.83,31.43 146.37,31.43
  Bottom 0.127: 150.18,46.67 151.76,48.26 IC42.12 | 150.18,46.67 v148.91,45.4 | SV1.8 171.13,54.29 171.13,46.67 150.18,46.67 | v50.48,63.18 50.16,62.87 25.4,62.87 24.45,61.91 24.45,59.37 26.35,59.37 IC29.12 | v113.67,80.96 v103.19,80.96 | v51.75,33.02 53.02,31.75 107.31,31.75 109.22,29.84 113.67,29.84 v113.98,30.16 118.43,30.16 119.06,29.53 119.7,29.53 120.33,30.16 142.56,30.16 v143.83,31.43
ALU0  (via drill 0.25)
  Top 0.127: v107.63,80.33 107.63,65.09 107.31,64.77 107.31,61.59 IC34.11 106.68,57.15 v106.05,56.52 | v65.09,70.48 65.09,63.18 71.75,56.52 v71.75,55.88 | v126.36,76.83 127,77.47 IC5.1
  Bottom 0.127: 169.23,86.36 169.23,78.42 167.96,77.15 166.05,77.15 IC38.9 160.97,72.07 140.65,72.07 135.89,76.83 v126.36,76.83 | IC37.9 169.23,86.36 | IC40.14 158.43,105.73 165.42,105.73 169.23,101.92 169.23,86.36 | v107.63,80.33 123.51,80.33 125.09,78.74 IC5.1 | X1.B24 8.57,75.25 29.21,75.25 29.53,75.56 40.64,75.56 42.23,73.98 42.23,71.12 58.1,71.12 58.74,70.48 v65.09,70.48 | v71.75,55.88 72.39,55.24 90.81,55.24 91.12,54.93 97.47,54.93 98.11,55.56 105.09,55.56 v106.05,56.52
ALU1  (via drill 0.25)
  Top 0.127: IC40.2 151.45,105.73 166.69,105.73 166.69,90.49 167.64,89.53 IC37.10 | IC34.10 109.22,64.14 108.27,65.09 v108.27,77.47
  Bottom 0.127: IC37.10 166.69,86.36 166.69,78.42 165.42,77.15 163.51,77.15 IC38.10 156.53,77.15 127.95,77.15 | 127.95,77.15 126.68,77.15 126.36,77.47 123.83,77.47 123.51,77.15 108.58,77.15 v108.27,77.47 108.27,79.06 107,80.33 103.82,80.33 103.5,80.01 100.97,80.01 100.65,80.33 73.34,80.33 73.03,80.01 70.17,80.01 69.85,80.33 9.21,80.33 X1.B25 | IC5.2 127.95,77.15
ALU2  (via drill 0.25)
  Top 0.127: IC34.9 110.81,61.91 110.81,75.25 | 110.81,75.25 110.81,104.46 v105.73,109.54 | IC5.3 131.44,78.11 v131.44,75.25 | 110.81,75.25 v112.39,75.25
  Bottom 0.127: v105.73,109.54 105.09,110.17 98.11,110.17 | IC36.14 98.11,110.17 | v131.44,75.25 131.13,75.56 112.71,75.56 v112.39,75.25 | X1.B26 6.03,82.87 4.45,82.87 3.81,83.5 3.81,98.42 4.13,98.42 6.35,100.65 6.35,110.49 90.81,110.49 91.12,110.17 98.11,110.17
ALU3  (via drill 0.25)
  Top 0.127: 105.73,49.21 IC33.12 | 105.73,49.21 105.73,56.2 105.09,56.83 105.09,75.56 104.78,75.88 104.78,76.83 105.73,77.79 105.73,93.34 106.05,93.66 106.05,97.79 105.09,98.74 105.09,112.71 104.46,113.35 94.93,113.35 94.93,105.09 IC36.2 | v100.97,33.97 105.73,33.97 105.73,49.21
  Bottom 0.127: X1.B3 9.21,24.45 9.21,32.07 42.55,32.07 44.13,33.66 70.48,33.66 70.8,33.97 78.11,33.97 79.69,32.38 92.08,32.38 93.66,33.97 v100.97,33.97
ALU-FUNC  (via drill 0.25)
  Top 0.127: v76.83,87.95 75.25,89.53 75.25,105.09 77.15,107 76.52,107.63 8.57,107.63 8.57,84.77 X1.B27
  Bottom 0.127: IC9.11 109.86,88.27 77.15,88.27 v76.83,87.95
BDATA0  (via drill 0.25)
  Top 0.127: IC19.2 29.53,16.83 29.53,32.7 31.43,34.61 31.43,44.77 30.48,45.72 IC17.18 | v82.23,0.95 IC25.2 | IC21.2 150.81,0.95 135.89,0.95 135.89,26.67 IC43.6 | 49.21,60.01 v49.21,50.8 49.21,36.51 IC20.18 48.26,31.43 49.53,30.16 49.53,0.95 59.37,0.95 IC28.2 | IC10.15 49.21,60.01 | v73.98,50.8 73.98,53.02 V2.2 73.66,58.1 v74.3,58.74 | 49.21,85.41 IC14.18 | 49.21,60.01 49.21,85.41 | v46.67,94.93 49.21,92.39 49.21,85.41
  Bottom 0.127: IC28.2 56.83,6.67 52.39,6.67 | 52.39,6.67 36.51,6.67 IC19.2 | v82.23,0.95 81.92,0.64 58.42,0.64 52.39,6.67 | IC21.2 153.99,0.95 176.21,0.95 176.21,56.52 173.35,59.37 161.61,59.37 IC31.10 157.8,58.74 143.19,58.74 142.24,59.69 139.7,59.69 138.75,58.74 117.79,58.74 117.16,59.37 114.94,59.37 113.67,58.1 93.03,58.1 91.76,59.37 87.31,59.37 86.68,58.74 v74.3,58.74 | v49.21,50.8 v73.98,50.8 | RN1.2 23.18,94.93 v46.67,94.93
BDATA1  (via drill 0.25)
  Top 0.127: IC20.16 52.7,36.2 52.7,42.55 52.39,42.86 52.39,54.93 | 52.39,54.93 52.39,66.36 52.07,66.67 52.07,84.14 | 52.07,84.14 52.07,85.09 IC14.16 | RN1.3 17.46,103.19 v17.46,86.68 | 52.07,84.14 v52.39,84.14 | 52.39,54.93 v52.7,54.93 | IC28.5 66.99,4.13 61.91,4.13 61.91,1.59 60.96,0.64 | 60.96,0.64 33.02,0.64 IC19.4 32.07,16.19 32.07,41.59 32.38,41.91 32.38,47.62 IC17.17 | IC25.5 92.39,3.49 92.39,10.48 93.03,11.11 | 93.03,11.11 93.66,11.75 94.93,11.75 94.93,1.59 93.98,0.64 84.77,0.64 84.77,3.49 84.14,4.13 82.23,4.13 82.23,1.59 81.28,0.64 60.96,0.64 | IC43.2 123.83,27.3 v123.83,25.4 | v92.71,25.08 93.03,24.77 93.03,11.11 | IC21.5 159.38,3.17 159.38,8.89 158.75,9.53 158.75,23.81 v159.07,24.13 | IC31.12 154.94,55.24 153.67,53.98 v153.67,25.08 | IC10.1 45.4,53.02 v45.4,51.12
  Bottom 0.127: IC10.1 47.31,54.93 v52.7,54.93 74.61,54.93 V2.3 | v17.46,86.68 18.73,85.41 41.59,85.41 42.55,84.45 52.07,84.45 v52.39,84.14 | 123.19,24.77 v123.83,25.4 | 123.19,24.77 93.03,24.77 v92.71,25.08 | v159.07,24.13 158.43,24.77 153.67,24.77 | 123.19,24.77 153.67,24.77 | 153.67,24.77 v153.67,25.08 | v45.4,51.12 44.13,49.85 34.61,49.85 IC17.17
BDATA2  (via drill 0.25)
  Top 0.127: IC17.16 36.51,47.31 36.51,22.54 37.47,21.59 37.47,15.88 IC19.6 v40.96,12.38 | IC28.10 68.58,8.89 | 68.58,8.89 68.58,8.57 60.64,8.57 59.69,9.53 59.69,23.5 57.47,25.72 57.47,34.61 IC20.14 58.74,35.88 v58.74,37.78 | v88.9,7.62 IC25.10 | 68.58,8.89 v69.53,7.94 | IC21.10 161.29,11.43 161.29,32.07 | 161.29,32.07 161.29,37.47 158.43,40.32 158.43,58.74 v157.8,59.37 | v125.41,33.34 125.41,34.61 IC43.15 124.14,35.88 v124.14,38.1 | 161.29,32.07 v156.84,32.07 | 54.93,102.23 54.93,101.92 56.83,100.01 56.83,91.12 58.42,89.53 IC14.14 | 54.93,102.23 54.93,105.73 56.2,105.73 59.69,102.23 59.69,85.72 62.23,83.19 62.23,62.23 IC10.10 60.96,59.69 v63.5,57.15 | 77.79,54.29 V2.4 | v77.79,57.15 77.79,54.29 | 54.93,102.23 v54.29,101.6 | v78.42,38.42 77.79,39.05 77.79,54.29
  Bottom 0.127: v88.9,7.62 87.95,6.67 70.8,6.67 v69.53,7.94 58.74,7.94 57.78,8.89 44.45,8.89 v40.96,12.38 | v157.8,59.37 153.99,59.37 IC31.13 | v125.41,33.34 125.73,33.66 142.88,33.66 144.46,32.07 v156.84,32.07 | v63.5,57.15 v77.79,57.15 | RN1.4 22.23,100.97 52.39,100.97 53.34,101.92 53.98,101.92 v54.29,101.6 | v124.14,38.1 123.83,38.42 v78.42,38.42 59.37,38.42 v58.74,37.78
BDATA3  (via drill 0.25)
  Top 0.127: 64.45,52.07 64.45,60.01 IC10.9 63.5,65.09 62.55,66.04 62.55,85.41 IC14.12 | 64.45,52.07 64.45,44.45 | 64.45,44.45 64.45,36.51 IC20.12 60.01,32.07 60.01,25.72 61.91,23.81 61.91,11.11 IC28.13 | v38.1,44.45 IC17.15 | 64.45,44.45 v61.59,44.45 | 64.45,52.07 v65.41,52.07 | RN1.5 21.91,103.82 v21.91,43.81 | v46.04,12.38 IC19.8 | v133.99,12.7 133.67,13.02 133.67,34.61 IC43.11 134.62,38.42 v134.94,38.73 | IC31.15 146.05,59.69 146.05,42.86 v141.92,38.73
  Bottom 0.127: v61.59,44.45 v38.1,44.45 37.78,44.13 22.23,44.13 v21.91,43.81 | V2.5 79.69,51.75 65.72,51.75 v65.41,52.07 | 62.55,11.75 IC28.13 | 82.23,11.75 62.55,11.75 | IC25.13 82.23,11.75 | IC21.13 150.81,11.75 133.99,11.75 | 82.23,11.75 133.99,11.75 | v46.04,12.38 46.67,11.75 62.55,11.75 | 133.99,11.75 v133.99,12.7 | v134.94,38.73 v141.92,38.73
BDATA4  (via drill 0.25)
  Top 0.127: RN1.6 24.13,54.61 IC29.2 | IC32.10 134.62,57.78 133.35,56.52 133.35,6.99 131.44,6.99 130.81,7.62 130.81,8.89 IC22.13 129.22,10.48 v129.22,13.02 | IC26.13 107.95,11.43 107.95,13.34 | 107.95,13.34 107.95,26.67 IC44.6 | IC19.11 48.58,23.18 v48.58,25.4 46.99,26.99 46.99,46.35 v46.67,46.67 | V2.9 83.5,60.64 83.5,57.47 80.33,54.29 80.33,27.62 77.15,24.45 74.61,24.45 74.61,21.91 71.12,18.41 64.45,18.41 64.45,26.99 IC20.9 | 107.95,13.34 v107.63,13.34
  Route2 0.127: IC14.9 66.99,75.25 69.53,75.25 IC11.15
  Route15 0.127: IC11.15 77.79,66.99 77.79,65.72 80.96,62.55 82.23,62.55 V2.9
  Bottom 0.127: IC29.2 25.4,49.85 30.8,49.85 32.07,48.58 32.07,46.67 39.05,46.67 IC17.14 42.23,46.67 v46.67,46.67 | v48.58,25.4 49.21,26.04 61.59,26.04 | IC20.9 61.59,26.04 | IC44.6 107.63,26.35 75.25,26.35 74.93,26.04 61.59,26.04 | v129.22,13.02 128.91,13.34 v107.63,13.34
BDATA5  (via drill 0.25)
  Top 0.127: IC22.2 127.95,0.95 126.05,0.95 126.05,5.71 | 126.05,5.71 126.05,37.78 127.95,39.69 127.95,42.55 127.64,42.86 127.64,46.99 128.59,47.94 128.59,51.44 128.91,51.75 128.91,52.07 128.59,52.39 128.59,56.2 129.54,57.15 IC32.12 | v109.22,5.08 IC26.2 105.09,0.95 103.82,0.95 100.01,4.76 100.01,20 98.11,21.91 98.11,26.99 IC44.2 97.79,29.21 97.79,58.42 97.47,58.74 v97.47,63.18 | 126.05,5.71 v125.41,5.71 | IC19.13 42.23,23.81 42.23,29.53 | 42.23,29.53 42.23,47.31 IC17.13 43.18,50.8 v42.55,51.44 | 42.23,29.53 v43.81,29.53 | RN1.7 24.45,101.92 24.45,56.52 v25.72,55.24 | IC14.7 58.74,78.42 58.74,75.25 59.69,74.3 59.69,50.16 | 59.69,50.16 59.69,44.45 61.91,42.23 61.91,38.42 59.69,36.2 59.69,29.21 IC20.7 | v62.87,65.09 62.55,64.77 62.55,58.74 64.14,57.15 64.14,55.88 61.91,53.66 61.91,52.39 59.69,50.16 | v82.23,63.18 81.28,62.23 V2.10
  Route15 0.127: V2.10 77.79,64.45 70.17,64.45 IC11.1
  Bottom 0.127: v109.22,5.08 109.86,5.71 123.83,5.71 124.14,6.03 125.09,6.03 v125.41,5.71 | 33.02,51.75 33.02,51.44 v42.55,51.44 | 33.02,51.75 IC29.5 | IC20.7 56.83,29.53 v43.81,29.53 | v25.72,55.24 26.99,53.98 26.99,51.75 33.02,51.75 | IC11.1 67.63,65.09 v62.87,65.09 | v82.23,63.18 v97.47,63.18
BDATA6  (via drill 0.25)
  Top 0.127: IC19.15 41.59,19.37 44.77,19.37 44.77,26.35 | 44.77,26.35 44.77,32.38 46.67,34.29 46.67,46.04 45.72,46.99 IC17.12 | 44.77,26.35 v46.04,26.35 | IC14.5 54.61,77.47 54.61,64.14 54.29,63.82 54.29,59.37 | 54.29,59.37 54.29,28.89 IC20.5 | IC44.15 98.11,36.51 v98.11,58.74 | IC11.10 82.87,72.71 v82.87,59.69 | v31.75,102.55 30.8,101.6 30.8,63.5 33.02,61.28 IC29.10 | IC22.5 136.21,3.49 136.21,33.34 135.57,33.97 135.57,44.77 135.25,45.09 135.25,46.99 135.57,47.31 v135.57,59.37 | v53.98,59.37 54.29,59.37
  Route2 0.127: IC26.5 118.43,6.67 133.03,6.67 IC22.5
  Bottom 0.127: IC20.5 51.75,26.35 v46.04,26.35 | IC29.10 34.61,59.37 v53.98,59.37 67.63,59.37 67.94,59.69 70.48,59.69 70.8,59.37 77.15,59.37 | V2.11 77.15,59.37 | 97.47,59.37 v98.11,58.74 | 97.47,59.37 92.39,59.37 92.08,59.69 87,59.69 86.68,59.37 82.87,59.37 | 77.15,59.37 82.87,59.37 | 125.41,59.37 IC32.13 | 125.41,59.37 117.79,59.37 117.47,59.69 112.39,59.69 112.08,59.37 97.47,59.37 | 82.87,59.37 v82.87,59.69 | RN1.8 30.8,102.55 v31.75,102.55 | 125.41,59.37 v135.57,59.37
BDATA7  (via drill 0.25)
  Top 0.127: IC19.17 37.15,18.73 37.15,14.29 39.69,11.75 49.21,11.75 49.21,26.99 IC20.3 47.31,28.89 47.31,47.31 | 47.31,47.31 IC17.11 | IC14.3 47.31,77.79 v47.31,62.23 47.31,47.31 | v113.67,32.38 113.35,32.07 113.35,11.11 IC26.10 | RN1.9 31.11,103.5 31.11,102.55 30.48,101.92 30.48,63.18 v31.43,62.23 | IC11.9 85.41,72.71 v85.41,62.23 | IC44.11 107.95,36.83 v107.95,62.23
  Route15 0.127: IC22.10 135.57,11.75 115.89,11.75 IC26.10
  Bottom 0.127: IC44.11 112.39,32.38 v113.67,32.38 | IC29.13 26.99,62.55 31.43,62.55 | 74.61,62.55 47.31,62.55 | 47.31,62.55 31.43,62.55 | V2.12 74.61,62.55 | 31.43,62.55 v31.43,62.23 | 85.09,62.55 v85.41,62.23 | 74.61,62.55 85.09,62.55 | IC32.15 120.33,62.55 107.95,62.55 | 85.09,62.55 107.95,62.55 | 107.95,62.55 v107.95,62.23 | 47.31,62.55 v47.31,62.23
BDATA8  (via drill 0.25)
  Top 0.127: v94.93,87.63 95.25,87.31 95.25,77.15 96.52,75.88 IC12.15 | v38.73,26.99 41.59,29.84 41.59,72.07 IC18.18 39.69,77.15 39.69,102.55 RN2.2
  Route15 0.127: IC15.18 67.63,75.25 45.09,75.25 43.5,73.66 IC18.18
  Bottom 0.127: IC15.18 80.33,87.95 94.61,87.95 v94.93,87.63 | V1.2 25.08,25.72 37.47,25.72 v38.73,26.99
BDATA9  (via drill 0.25)
  Top 0.127: v89.53,66.99 87.31,69.22 87.31,74.61 84.77,77.15 84.77,81.6 | 84.77,81.6 84.77,85.41 IC15.16 | V1.3 27.3,29.84 v27.3,30.16 | v42.86,31.75 44.45,33.34 44.45,71.44 45.72,72.71 IC18.17 45.72,74.61 44.77,75.56 44.77,80.96 | v44.13,102.55 44.77,101.92 44.77,80.96 | v82.87,81.6 84.77,81.6 | 44.77,80.96 v48.58,80.96
  Bottom 0.127: IC12.1 93.03,66.99 v89.53,66.99 | v27.3,30.16 28.89,31.75 v42.86,31.75 | RN2.3 42.23,102.55 v44.13,102.55 | v82.87,81.6 72.71,81.6 71.44,80.33 70.48,80.33 69.85,80.96 v48.58,80.96
BDATA10  (via drill 0.25)
  Top 0.127: v37.47,26.35 41.91,26.35 41.91,70.48 44.13,72.71 44.13,75.25 | 44.13,75.25 44.13,101.92 43.18,102.87 RN2.4 | 44.13,75.25 v44.45,75.25 | IC15.14 87.63,85.09 v87.63,75.25
  Bottom 0.127: V1.4 29.53,26.35 v37.47,26.35 | 46.67,75.25 IC18.16 | v44.45,75.25 46.67,75.25 | IC12.10 107.63,75.25 v87.63,75.25 46.67,75.25
BDATA11  (via drill 0.25)
  Top 0.127: V1.5 31.11,28.57 v31.11,30.16 | v49.21,31.11 49.85,31.75 49.85,55.56 49.53,55.88 49.53,72.39 | IC18.15 49.53,72.39 | RN2.5 49.53,100.33 49.53,72.39 | IC15.12 93.03,85.41 v93.03,72.39
  Bottom 0.127: v31.11,30.16 32.38,31.43 42.55,31.43 42.86,31.11 v49.21,31.11 | IC12.9 110.17,72.07 93.34,72.07 v93.03,72.39 87,72.39 86.68,72.07 52.39,72.07 IC18.15
BDATA12  (via drill 0.25)
  Top 0.127: IC15.9 94.61,78.11 94.61,74.93 94.93,74.61 v94.93,70.8 93.03,68.9 v93.03,57.15 | v45.09,37.15 44.77,37.47 44.77,57.78 | 44.77,57.78 44.77,67.63 v46.04,68.9 | v53.02,70.48 53.34,70.8 IC18.14 53.34,75.88 v53.02,76.2 | RN2.6 49.85,102.55 49.85,89.22 51.75,87.31 51.75,76.52 v51.44,76.2 | 44.77,57.78 v46.67,57.78
  Bottom 0.127: v94.93,70.8 95.25,71.12 105.73,71.12 106.36,70.48 114.3,70.48 119.06,75.25 120.33,75.25 IC13.15 | V1.9 34.61,37.15 v45.09,37.15 | v46.04,68.9 47.62,70.48 v53.02,70.48 | v53.02,76.2 v51.44,76.2 | v93.03,57.15 78.42,57.15 77.79,57.78 69.22,57.78 68.9,57.47 63.82,57.47 63.5,57.78 v46.67,57.78
BDATA13  (via drill 0.25)
  Top 0.127: v89.53,68.9 89.22,69.22 89.22,71.12 | 89.22,71.12 89.22,78.42 IC15.7 | V1.10 29.21,36.83 29.21,73.98 30.16,74.93 30.16,102.55 30.8,103.19 30.8,105.09 31.43,105.73 50.8,105.73 RN2.7 52.39,102.55 52.39,98.11 54.29,96.2 54.29,81.6 54.93,80.96 54.93,74.61 IC18.13 55.88,70.48 v56.52,69.85 | v89.53,71.12 89.22,71.12
  Bottom 0.127: IC13.1 118.11,67.31 112.39,67.31 112.08,67.63 100.65,67.63 100.33,67.94 92.08,67.94 91.76,67.63 90.81,67.63 v89.53,68.9 | v89.53,71.12 89.22,70.8 66.99,70.8 66.04,69.85 v56.52,69.85
BDATA14  (via drill 0.25)
  Top 0.127: v42.86,37.78 44.13,39.05 v44.13,71.75 | v58.42,71.44 IC18.12 58.42,75.88 57.47,76.83 57.47,79.06 54.93,81.6 54.93,82.23 | RN2.8 53.66,103.82 53.66,101.6 54.93,100.33 54.93,82.23 | IC15.5 80.64,81.92 v80.64,82.23 | 54.93,82.23 v56.2,82.23
  Route15 0.127: v100.97,76.2 100.01,77.15 85.41,77.15 IC15.5
  Bottom 0.127: V1.11 30.16,37.78 v42.86,37.78 | v44.13,71.75 44.45,71.44 v58.42,71.44 | v56.2,82.23 v80.64,82.23 | IC13.10 134.62,76.2 112.71,76.2 112.39,76.52 101.28,76.52 v100.97,76.2
BDATA15  (via drill 0.25)
  Top 0.127: V1.12 24.45,36.51 24.45,50.48 26.35,52.39 26.35,65.72 26.04,66.04 v26.04,101.6 | IC18.11 61.91,74.61 61.91,82.87 59.37,85.41 59.37,96.2 57.15,98.42 57.15,102.87 RN2.9 | IC15.3 77.79,79.69 77.79,88.9 78.11,89.22 | 78.11,89.22 78.11,90.17 77.47,90.81 v77.47,104.14 | IC13.9 136.21,74.61 v136.21,87.63 | 78.11,89.22 v78.74,89.22
  Bottom 0.127: v26.04,101.6 26.35,101.92 51.44,101.92 52.07,102.55 54.29,102.55 RN2.9 v77.47,104.14 | v136.21,87.63 135.57,88.27 113.03,88.27 112.08,89.22 v78.74,89.22
BR-COND  (via drill 0.25)
  Top 0.127: IC35.8 92.71,46.99 v92.71,46.04
  Bottom 0.127: v92.71,46.04 90.49,43.81 84.45,43.81 84.14,44.13 62.55,44.13 61.91,43.5 54.93,43.5 49.85,38.42 13.02,38.42 X1.C8
C/SHIFT  (via drill 0.25)
  Top 0.127: IC33.13 103.19,49.21 103.19,60.01 IC34.12 | IC36.13 99.06,106.68 IC36.3 100.65,100.01 v100.65,96.84 96.52,92.71 96.52,89.85 97.79,88.58 97.79,63.5 v101.6,63.5 | IC8.5 166.69,89.85 166.69,56.83 SV1.9
  Route2 0.127: v101.6,63.5 IC34.12
  Bottom 0.127: v100.65,96.84 101.92,95.57 107.31,95.57 108.58,96.84 128.59,96.84 129.22,97.47 159.07,97.47 IC8.5
CO/BO
  Bottom 0.127: IC7.1 57.47,39.05 89.85,39.05 IC35.6
DATA0  (via drill 0.25)
  Top 0.127: IC17.2 26.99,41.59 26.99,54.93 v27.3,55.24
  Bottom 0.127: v27.3,55.24 23.18,59.37 17.14,59.37 11.43,65.09 6.03,65.09 X1.A20
DATA1  (via drill 0.25)
  Top 0.127: IC17.3 29.84,41.27 v29.84,46.35
  Bottom 0.127: v29.84,46.35 29.53,46.67 25.08,46.67 11.11,60.64 11.11,64.77 4.76,64.77 4.13,65.41 4.13,68.58 X1.A21
DATA2  (via drill 0.25)
  Top 0.127: IC17.4 33.97,41.59 33.97,64.45 v31.43,66.99
  Bottom 0.127: v31.43,66.99 28.26,70.17 6.03,70.17 X1.A22
DATA3  (via drill 0.25)
  Top 0.127: IC17.5 34.29,41.91 v34.29,68.26
  Bottom 0.127: v34.29,68.26 30.16,72.39 6.35,72.39 X1.A23
DATA4  (via drill 0.25)
  Top 0.127: IC17.6 39.05,41.59 39.05,74.61 v37.47,76.2
  Bottom 0.127: v37.47,76.2 36.51,77.15 6.03,77.15 X1.A24
DATA5  (via drill 0.25)
  Top 0.127: IC17.7 39.37,41.91 v39.37,76.2
  Bottom 0.127: v39.37,76.2 37.78,77.79 6.03,77.79 X1.A25
DATA6
  Bottom 0.127: IC17.8 41.59,42.23 4.45,42.23 3.49,43.18 3.49,81.28 X1.A26
DATA7  (via drill 0.25)
  Top 0.127: v4.45,41.59 4.13,41.91 4.13,82.87 X1.A27
  Bottom 0.127: IC17.9 43.81,38.73 13.65,38.73 10.79,41.59 v4.45,41.59
DATA8  (via drill 0.25)
  Top 0.127: IC18.2 40.01,66.67 v40.01,68.9
  Bottom 0.127: v40.01,68.9 35.24,73.66 X1.C23
DATA9  (via drill 0.25)
  Top 0.127: v17.14,67.63 11.11,73.66 11.11,75.25 X1.C24
  Bottom 0.127: IC18.3 41.59,64.45 20.32,64.45 v17.14,67.63
DATA10  (via drill 0.25)
  Top 0.127: IC18.4 46.67,66.99 46.67,74.61 v45.4,75.88
  Bottom 0.127: v45.4,75.88 44.77,76.52 39.69,76.52 37.47,78.74 X1.C25
DATA11  (via drill 0.25)
  Top 0.127: v17.46,64.14 17.78,64.45 17.78,72.07 11.11,78.74 11.11,80.33 X1.C26
  Bottom 0.127: IC18.5 46.35,64.14 v17.46,64.14
DATA12
  Bottom 0.127: IC18.6 49.21,67.63 32.7,67.63 31.43,66.36 26.99,66.36 25.08,68.26 12.06,68.26 10.48,69.85 4.76,69.85 4.13,70.48 4.13,80.33 8.26,80.33 9.21,81.28 9.21,83.82 X1.C27
DATA13  (via drill 0.25)
  Top 0.127: IC18.7 52.39,66.99 52.39,82.87 v52.7,83.19
  Bottom 0.127: v52.7,83.19 51.75,84.14 41.59,84.14 40.64,85.09 11.43,85.09 X1.C28
DATA14  (via drill 0.25)
  Top 0.127: v17.46,73.03 13.02,77.47 13.02,90.17 10.79,92.39 9.21,92.39 9.21,89.85 X1.C29
  Bottom 0.127: IC18.8 53.66,68.26 37.15,68.26 32.38,73.03 v17.46,73.03
DATA15  (via drill 0.25)
  Top 0.127: IC18.9 57.47,66.99 v57.47,76.2 | v12.38,79.69 11.11,80.96 11.11,90.49 X1.C30
  Bottom 0.127: v57.47,76.2 56.83,76.83 40.01,76.83 37.15,79.69 v12.38,79.69
GND
  pour Route15: 0,114.3 177.8,114.3 177.8,0 0,0 0,8.89 6.35,8.89 6.35,16.51 0,16.51 0,97.79 6.35,97.79 6.35,105.41 0,105.41
I/D-REG-DN  (via drill 0.25)
  Top 0.127: IC9.5 115.25,79.69 115.25,92.39 112.71,94.93 112.71,103.19 v106.68,109.22 | v7.94,106.36 6.03,104.46 6.03,39.69 X1.B9
  Bottom 0.127: v106.68,109.22 106.36,108.9 90.81,108.9 89.53,110.17 11.75,110.17 v7.94,106.36
I/D-REG-LD  (via drill 0.25)
  Top 0.127: IC9.3 110.49,77.47 110.49,43.81 110.81,43.5 110.81,21.27 v111.12,20.95
  Bottom 0.127: v111.12,20.95 84.45,20.95 84.14,21.27 79.69,21.27 79.38,20.95 53.98,20.95 53.66,21.27 52.7,21.27 52.39,20.95 30.48,20.95 28.89,22.54 28.89,25.4 X1.C4
I/D-REG-OUT  (via drill 0.25)
  Top 0.127: v64.77,31.11 64.77,46.99 IC7.10 66.04,55.56 v66.99,56.52 | IC9.1 102.55,77.15 102.55,63.82 100.33,61.59 v100.33,57.15
  Bottom 0.127: v64.77,31.11 64.45,30.8 49.53,30.8 48.9,30.16 41.59,30.16 40.96,29.53 11.75,29.53 X1.C5 | v100.33,57.15 99.69,56.52 92.08,56.52 91.76,56.83 78.11,56.83 77.79,56.52 69.22,56.52 68.9,56.83 67.31,56.83 v66.99,56.52
I/D-REG-UP  (via drill 0.25)
  Top 0.127: IC9.9 115.89,87.31 115.89,97.47 115.25,98.11 115.25,101.28 113.03,103.5 113.03,107.95 111.12,109.86 110.49,109.86 v110.49,107 | v75.25,106.36 18.1,106.36 18.1,49.53 10.16,41.59 7.62,41.59 X1.B10
  Bottom 0.127: v110.49,107 109.54,106.05 89.53,106.05 89.22,105.73 88.58,105.73 87.95,106.36 v75.25,106.36
INV-IN0  (via drill 0.25)
  Top 0.127: v72.71,89.22 73.66,90.17 IC3.2 74.61,92.39 74.61,105.09 v76.52,107 | IC39.18 120.02,109.86 v120.02,109.54 | IC45.18 153.35,34.61 153.35,26.99 153.03,26.67 153.03,23.5 IC24.18 152.08,22.54 v152.08,20.64 | IC23.18 v58.74,25.08 | IC30.18 90.81,23.5 v90.81,25.08 | v121.6,25.4 121.6,23.18 IC27.18 121.92,20.95 v122.24,20.64 | v39.05,87.95 36.83,85.72 36.83,25.4 v37.15,25.08
  Bottom 0.127: v72.71,89.22 45.4,89.22 IC2.2 39.69,87.95 v39.05,87.95 | v120.02,109.54 118.75,108.27 77.79,108.27 v76.52,107 | IC19.18 32.38,24.77 37.15,24.77 | 37.15,24.77 58.42,24.77 v58.74,25.08 v90.81,25.08 91.12,25.08 91.76,25.72 92.71,25.72 93.34,25.08 121.28,25.08 v121.6,25.4 | v152.08,20.64 150.81,19.37 138.11,19.37 136.84,20.64 v122.24,20.64 | 37.15,24.77 v37.15,25.08
INV-IN1  (via drill 0.25)
  Top 0.127: v124.78,109.54 IC39.16 | v80.01,107 79.69,106.68 79.69,92.39 IC3.4 80.01,90.17 80.01,33.97 74.93,28.89 74.93,26.04 72.07,23.18 72.07,20.95 69.85,18.73 66.04,18.73 IC23.16 | IC24.16 156.21,24.13 156.21,34.29 IC45.16
  Bottom 0.127: IC2.4 49.85,89.85 77.15,89.85 IC3.4 | v124.78,109.54 122.56,107.31 114.94,107.31 114.62,107.63 80.64,107.63 v80.01,107 | IC19.16 37.15,24.45 64.45,24.45 | IC23.16 64.45,24.45 | 94.93,24.45 IC30.16 | 64.45,24.45 94.93,24.45 | 125.41,24.45 IC27.16 | 94.93,24.45 125.41,24.45 | IC24.16 155.89,24.45 125.41,24.45
INV-IN2  (via drill 0.25)
  Top 0.127: IC2.6 53.66,91.76 v53.66,93.66 | v89.22,111.44 84.77,107 84.77,96.84 83.19,95.25 83.19,92.08 IC3.6 | IC27.14 132.72,23.5 v132.72,25.4 | IC45.14 161.61,34.61 161.61,23.81 IC24.14 | v43.5,20 IC19.14 | v69.85,20 71.12,21.27 IC23.14 67.63,26.35 67.63,57.47 64.45,60.64 v64.45,93.66 | v100.33,20.32 100.33,21.59 IC30.14 101.6,24.77 v102.55,25.72
  Bottom 0.127: v53.66,93.66 53.98,93.34 64.45,93.34 | 64.45,93.34 67.94,93.34 68.26,93.03 70.17,93.03 70.48,93.34 81.28,93.34 83.19,91.44 IC3.6 | IC39.14 130.49,113.35 91.12,113.35 v89.22,111.44 | IC24.14 159.7,25.72 153.67,25.72 153.03,25.08 133.03,25.08 v132.72,25.4 132.08,26.04 102.87,26.04 v102.55,25.72 | v43.5,20 44.45,19.05 68.9,19.05 v69.85,20 70.48,19.37 99.38,19.37 v100.33,20.32 | v64.45,93.66 64.45,93.34
INV-IN3  (via drill 0.25)
  Top 0.127: IC2.8 58.74,91.76 v58.74,95.57 | 86.36,94.61 88.9,92.08 IC3.8 90.49,89.85 90.49,45.72 89.85,45.09 89.85,33.34 84.77,28.26 84.77,26.35 78.11,19.68 76.2,19.68 IC23.12 | 86.36,94.61 v85.09,95.89 | v90.17,108.9 89.85,108.58 89.85,98.11 86.36,94.61 | IC45.12 166.69,34.61 166.69,23.81 IC24.12
  Bottom 0.127: v58.74,95.57 83.5,95.57 83.82,95.89 v85.09,95.89 | IC39.12 135.57,110.17 108.27,110.17 106.68,108.58 90.49,108.58 v90.17,108.9 | IC24.12 166.05,21.27 138.75,21.27 IC27.12 135.57,21.27 111.44,21.27 111.12,21.59 109.86,21.59 109.54,21.27 105.09,21.27 | IC19.12 47.31,21.27 52.07,21.27 52.39,21.59 55.24,21.59 55.56,21.27 74.61,21.27 | IC23.12 74.61,21.27 | 105.09,21.27 IC30.12 | 105.09,21.27 84.77,21.27 84.45,21.59 79.38,21.59 79.06,21.27 74.61,21.27
INV-IN4  (via drill 0.25)
  Top 0.127: v66.04,101.6 IC2.11 | v130.81,102.87 130.81,106.05 135.25,106.05 IC39.9 141.29,100.01 141.29,89.53 143.19,87.63 143.19,40.64 141.29,38.73 v141.29,16.19 | v93.66,102.55 93.98,102.23 IC3.11 | IC24.9 168.59,16.19 168.59,26.99 IC45.9
  Bottom 0.127: v66.04,101.6 66.36,101.28 83.5,101.28 85.41,99.38 85.41,97.79 85.72,97.79 86.04,97.47 92.39,97.47 IC3.11 | v130.81,102.87 130.49,102.55 v93.66,102.55 | IC19.9 47.31,13.65 74.61,13.65 | IC23.9 74.61,13.65 | 74.61,13.65 105.09,13.65 IC30.9 108.27,13.65 135.57,13.65 | 135.57,13.65 IC27.9 | IC24.9 166.05,13.65 141.29,13.65 | 135.57,13.65 141.29,13.65 | 141.29,13.65 v141.29,16.19
INV-IN5  (via drill 0.25)
  Top 0.127: IC2.13 59.05,99.69 v59.05,101.6 | v85.41,102.23 88.9,102.23 IC3.13 | IC24.7 163.51,16.19 163.51,26.99 IC45.7 | v69.53,13.02 71.12,14.61 IC23.7 | IC30.7 100.65,14.29 v100.65,13.02 | IC27.7 131.44,14.61 v131.44,13.02 | IC39.7 133.35,102.87 133.35,89.53 135.89,87 135.89,64.14 139.7,60.33 139.7,50.16 140.65,49.21 v140.65,13.02
  Bottom 0.127: v59.05,101.6 59.69,102.23 v85.41,102.23 85.72,101.92 93.66,101.92 93.98,102.23 132.08,102.23 IC39.7 | IC19.7 42.55,13.34 69.22,13.34 | v69.53,13.02 69.22,13.34 | 69.22,13.34 100.33,13.34 v100.65,13.02 101.28,12.38 130.81,12.38 v131.44,13.02 131.76,13.34 140.65,13.34 | IC24.7 164.15,16.83 167.96,16.83 168.59,16.19 168.59,13.34 140.65,13.34 | 140.65,13.34 v140.65,13.02
INV-IN6  (via drill 0.25)
  Top 0.127: v53.34,101.28 IC2.15 | v127,101.6 IC39.5 | IC24.5 158.43,16.19 158.43,26.99 IC45.5 | v94.93,97.47 95.57,96.84 95.57,77.47 97.47,75.56 97.47,65.09 95.57,63.18 95.57,56.2 95.89,55.88 95.89,54.61 95.25,53.98 95.25,16.51 IC30.5
  Bottom 0.127: v53.34,101.28 53.66,100.97 82.55,100.97 83.82,99.69 IC3.15 83.82,98.74 85.41,97.16 93.98,97.16 94.61,97.79 | v127,101.6 126.36,100.97 110.49,100.97 109.86,101.6 98.42,101.6 94.61,97.79 | IC19.5 37.15,16.83 64.45,16.83 IC23.5 67.63,16.83 85.41,16.83 85.72,17.14 94.61,17.14 IC30.5 98.11,16.83 125.41,16.83 | IC27.5 125.41,16.83 | IC24.5 155.89,16.83 125.41,16.83 | v94.93,97.47 94.61,97.79
INV-IN7  (via drill 0.25)
  Top 0.127: v60.33,12.7 60.96,13.34 IC23.3 | v88.9,12.7 IC30.3 92.39,16.19 v92.39,17.78 | IC24.3 151.45,16.19 v151.45,19.05 151.45,26.99 IC45.3 | IC27.3 120.97,16.19 120.97,18.41 | 120.97,18.41 120.97,54.61 122.87,56.52 122.87,96.2 120.97,98.11 120.97,103.19 IC39.3 121.92,106.05 v120.02,107.95 | 120.97,18.41 v122.24,18.41 | IC3.17 79.06,99.38 v79.06,107
  Bottom 0.127: IC19.3 32.7,13.02 60.01,13.02 v60.33,12.7 60.64,12.38 88.58,12.38 v88.9,12.7 | IC2.17 50.16,97.16 67.94,97.16 68.58,97.79 70.48,97.79 70.8,97.47 77.15,97.47 IC3.17 | v151.45,19.05 151.13,18.73 134.62,18.73 134.3,18.41 v122.24,18.41 121.92,18.73 113.98,18.73 112.71,17.46 92.71,17.46 v92.39,17.78 | v79.06,107 80.01,107.95 v120.02,107.95
LD-AC  (via drill 0.25)
  Top 0.127: v127.64,92.08 126.36,92.08 125.73,92.71 125.73,97.79 IC6.11 123.51,100.01 123.51,105.41 v122.56,106.36 | X1.B28 6.67,87.31 v6.67,89.53
  Bottom 0.127: v127.64,92.08 129.86,89.85 140.65,89.85 IC4.5 | v6.67,89.53 6.67,105.73 87.95,105.73 88.27,105.41 90.81,105.41 91.12,105.73 120.33,105.73 120.97,106.36 v122.56,106.36
N$1
  Route15 0.127: IC35.4 88.58,38.42 111.44,38.42 IC44.9
N$2  (via drill 0.25)
  Top 0.127: v83.82,43.18 IC35.3 | v135.89,45.09 136.21,44.77 136.21,33.97 136.84,33.34 136.84,28.26 IC43.7
  Bottom 0.127: v83.82,43.18 97.16,43.18 98.74,44.77 108.58,44.77 108.9,45.09 121.28,45.09 121.6,44.77 135.57,44.77 v135.89,45.09
N$3
  Top 0.127: IC4.4 IC4.3
N$4  (via drill 0.25)
  Top 0.127: IC9.13 108.27,87.95 v108.27,95.89 | v144.15,95.57 144.78,94.93 IC4.6
  Bottom 0.127: v108.27,95.89 108.58,95.57 v144.15,95.57
N$5  (via drill 0.25)
  Top 0.127: IC9.12 110.17,87.31 v110.17,93.98
  Bottom 0.127: v110.17,93.98 110.49,93.66 127.95,93.66 129.22,94.93 156.53,94.93 IC8.3
N$6  (via drill 0.25)
  Top 0.127: V2.13 74.3,61.59 v74.3,63.5 | v96.84,63.82 96.52,63.5 IC34.15 | IC33.4 108.27,41.59 108.27,61.91 108.58,62.23 v108.58,63.18
  Bottom 0.127: v74.3,63.5 74.61,63.82 v96.84,63.82 97.16,64.14 107.63,64.14 v108.58,63.18
N$7  (via drill 0.25)
  Top 0.127: IC7.3 59.37,39.05 59.37,30.48 v59.05,30.16 | v100.33,29.53 100.33,37.15 102.87,39.69 102.87,75.56 105.41,78.11 v105.41,93.66
  Bottom 0.127: v59.05,30.16 59.69,29.53 v100.33,29.53 | v105.41,93.66 105.73,93.34 128.91,93.34 129.22,93.03 155.89,93.03 IC8.2
N$8  (via drill 0.25)
  Top 0.127: v108.9,44.45 109.22,44.77 IC33.11
  Bottom 0.127: IC35.1 80.64,42.55 97.16,42.55 99.06,44.45 v108.9,44.45
N$9  (via drill 0.25)
  Top 0.127: v80.96,46.67 85.41,42.23 85.41,36.51 IC1.9
  Bottom 0.127: IC7.8 72.39,46.99 78.11,46.99 78.42,46.67 v80.96,46.67
N$10
  Top 0.127: LED1.A 173.99,5.08 R1.1
N$11
  Top 0.127: IC8.12 162.56,101.6 IC40.7
N$25  (via drill 0.25)
  Top 0.127: IC43.3 128.27,29.21 v128.27,38.1
  Bottom 0.127: v128.27,38.1 141.92,38.1 142.56,38.73 142.56,42.23 138.75,42.23 IC41.6
N$26  (via drill 0.25)
  Top 0.127: IC43.14 127.64,36.2 127.64,38.73 128.27,39.37 v128.27,42.86 | v136.84,42.55 139.7,45.4 IC41.8
  Bottom 0.127: v128.27,42.86 128.59,42.55 v136.84,42.55
N$27
  Top 0.127: IC43.12 133.03,36.51 133.03,47.31 IC41.11
N$28
  Top 0.127: IC43.5 131.13,28.89 131.13,39.05 IC41.3
N$29  (via drill 0.25)
  Top 0.127: v109.22,30.48 IC44.5 | v141.92,31.11 143.83,33.02 v143.83,38.1
  Bottom 0.127: v109.22,30.48 109.86,31.11 118.75,31.11 119.06,31.43 137.48,31.43 137.79,31.11 v141.92,31.11 | v143.83,38.1 144.78,39.05 150.81,39.05 IC42.3
N$30
  Bottom 0.127: IC44.3 103.19,29.53 118.43,29.53 118.75,29.21 121.28,29.21 121.92,29.84 144.15,29.84 144.46,29.53 146.37,29.53 146.69,29.84 157.48,29.84 159.07,28.26 159.07,26.35 160.34,26.35 160.97,26.99 160.97,40.64 IC42.6
N$31  (via drill 0.25)
  Top 0.127: IC44.14 105.09,39.05 v105.09,43.81 | v159.07,43.18 162.56,46.67 IC42.8
  Bottom 0.127: v105.09,43.81 104.46,43.81 103.82,43.18 103.82,42.55 121.28,42.55 121.6,42.23 123.51,42.23 124.78,43.5 130.49,43.5 130.81,43.18 143.51,43.18 144.46,42.23 152.4,42.23 153.35,43.18 v159.07,43.18
N$32  (via drill 0.25)